# Altium project MB988.PrjPCB (part 1 of 2)
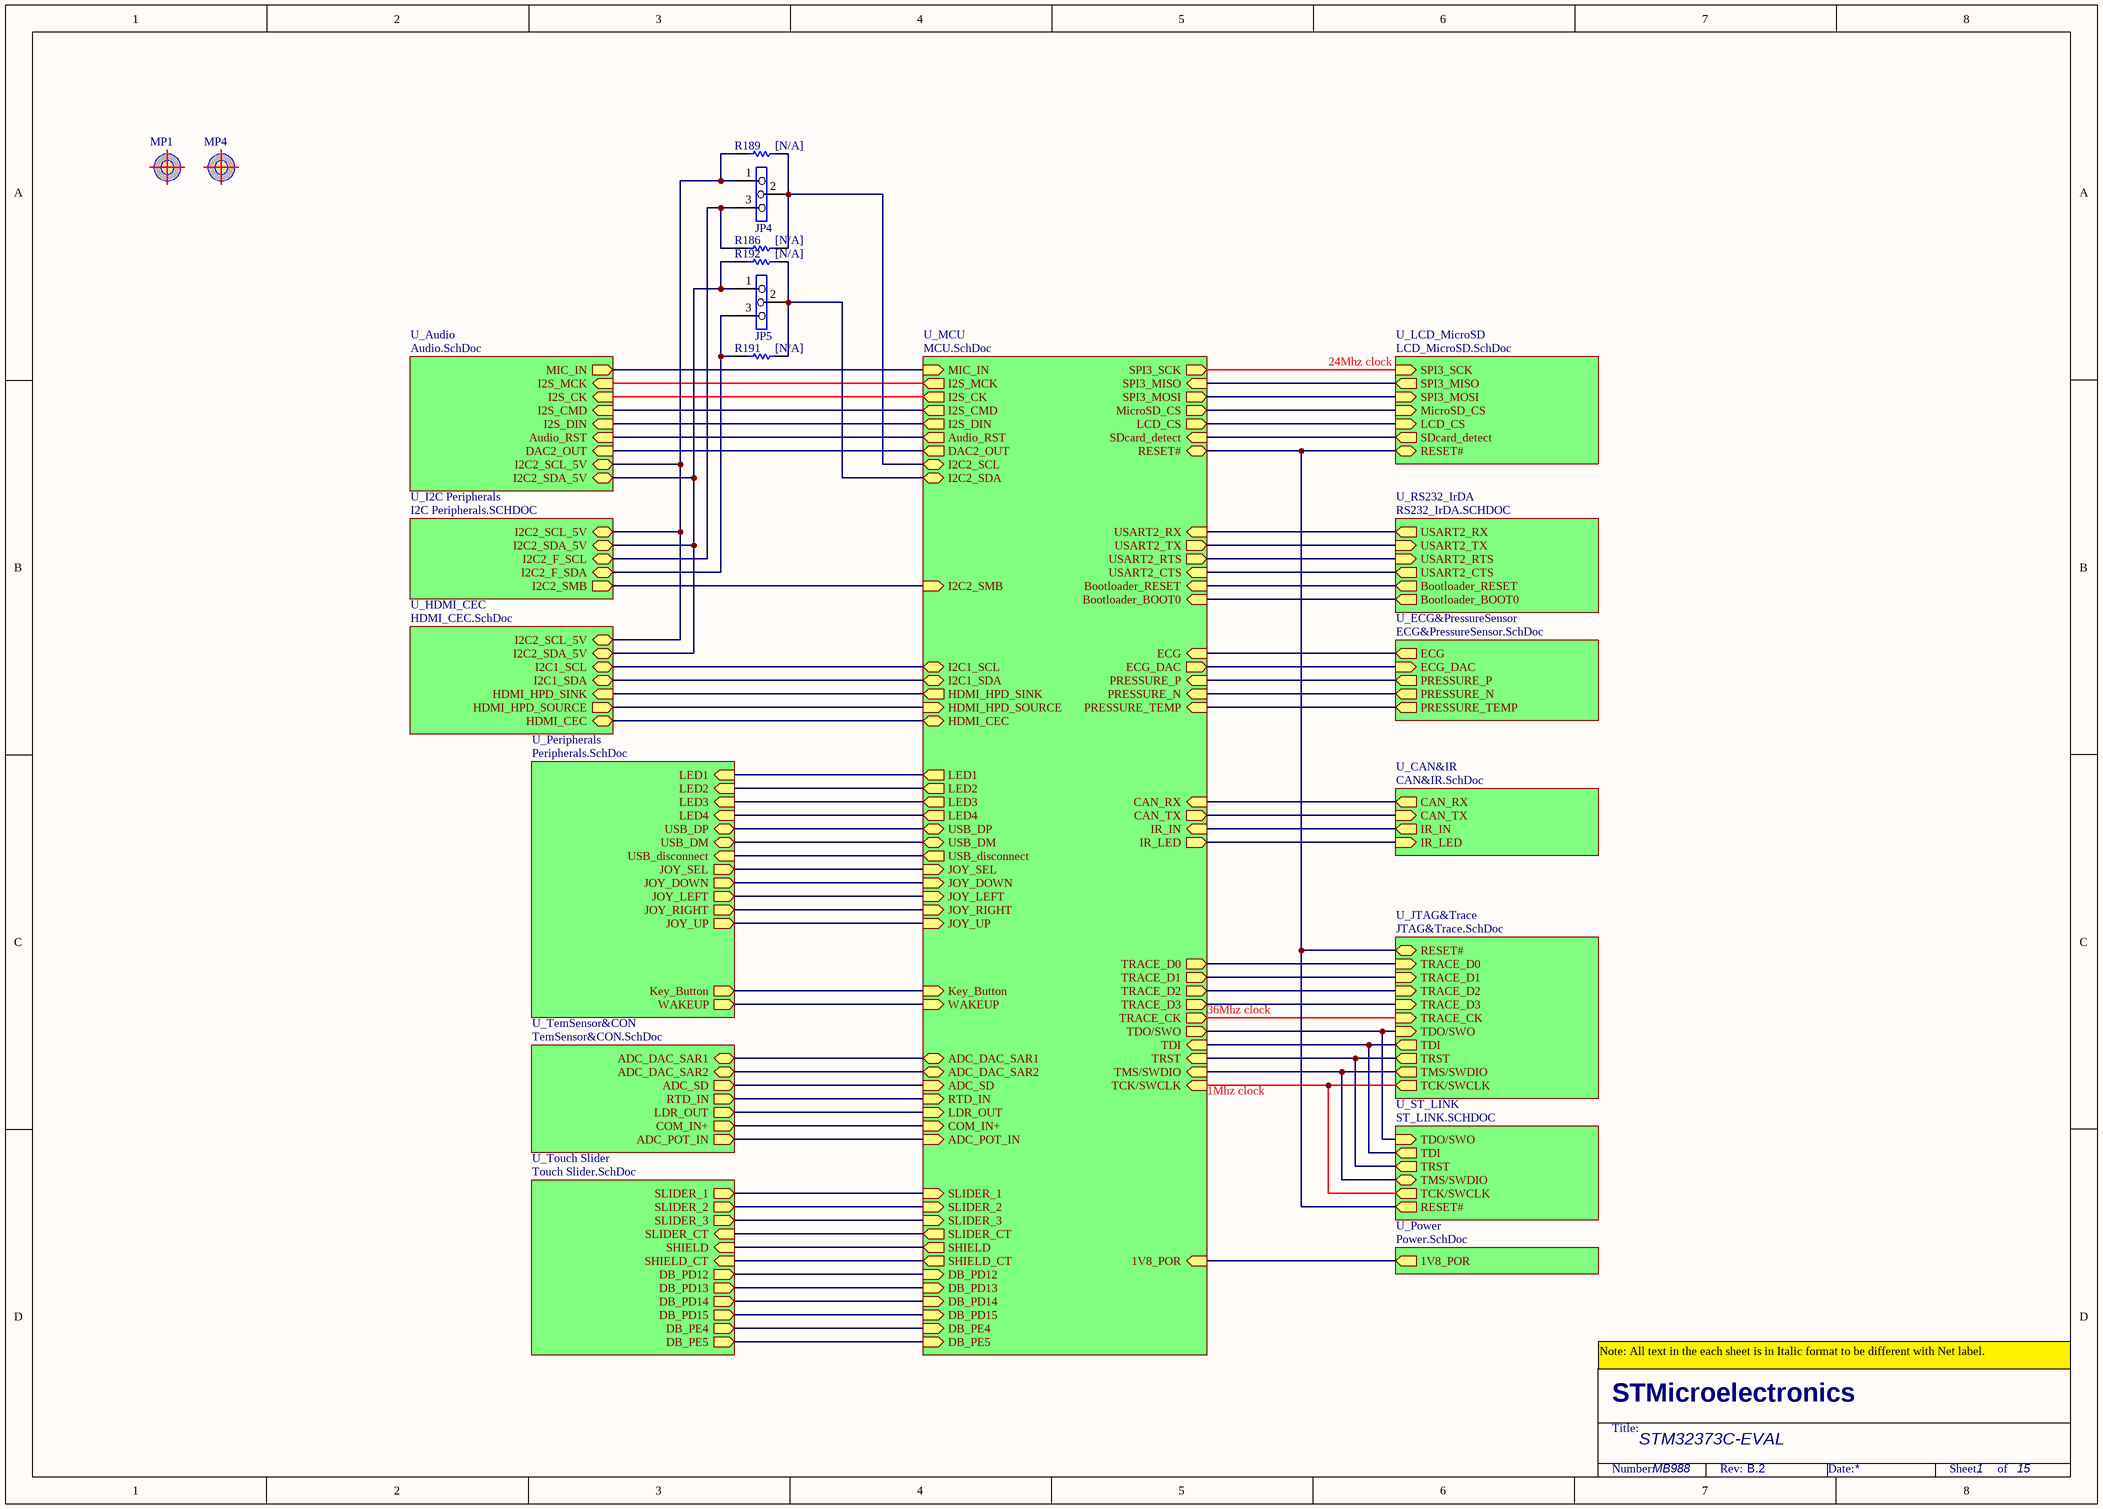
[diagram p0: MB988.SchDoc]
15 sheets, 536 parts. Net scope: hierarchical (ports join the sheet entries above them; power ports are global).
Sheets:
  MB988.SchDoc
    U_MCU = MCU.SchDoc
    U_Peripherals = Peripherals.SchDoc
    U_ECG&PressureSensor = ECG&PressureSensor.SchDoc
    U_TemSensor&CON = TemSensor&CON.SchDoc
    U_JTAG&Trace = JTAG&Trace.SchDoc
    U_ST_LINK = ST_LINK.SCHDOC
    U_Power = Power.SchDoc
    U_LCD_MicroSD = LCD_MicroSD.SchDoc
    U_Audio = Audio.SchDoc
    U_I2C Peripherals = I2C Peripherals.SCHDOC
    U_HDMI_CEC = HDMI_CEC.SchDoc
    U_RS232_IrDA = RS232_IrDA.SCHDOC
    U_Touch Slider = Touch Slider.SchDoc
    U_CAN&IR = CAN&IR.SchDoc

## Sheet MB988.SchDoc
size A3; Revision: B.2

### Parts
JP4  (no value)  [SIP3]
JP5  (no value)  [SIP3]
MP1  (no value)  [markpoint_1.0]
MP4  (no value)  [markpoint_1.0]
R186  [N/A]  [0603R]
R189  [N/A]  [0603R]
R191  [N/A]  [0603R]
R192  [N/A]  [0603R]

### Sub-sheets
U_Audio = Audio.SchDoc: I2S_CMD (in), I2S_DIN (in), I2S_CK (in), I2C2_SCL_5V (bidir), I2C2_SDA_5V (bidir), Audio_RST (in), I2S_MCK (in), DAC2_OUT (in), MIC_IN (out)
U_CAN&IR = CAN&IR.SchDoc: CAN_TX (in), CAN_RX (out), IR_LED (in), IR_IN (out)
U_ECG&PressureSensor = ECG&PressureSensor.SchDoc: ECG (out), PRESSURE_P (out), PRESSURE_N (out), ECG_DAC (in), PRESSURE_TEMP (out)
U_HDMI_CEC = HDMI_CEC.SchDoc: HDMI_HPD_SINK (in), I2C2_SDA_5V (bidir), I2C2_SCL_5V (bidir), HDMI_CEC (bidir), HDMI_HPD_SOURCE (out), I2C1_SCL (bidir), I2C1_SDA (bidir)
U_I2C Peripherals = I2C Peripherals.SCHDOC: I2C2_SCL_5V (bidir), I2C2_SDA_5V (bidir), I2C2_SMB (out), I2C2_F_SDA (bidir), I2C2_F_SCL (bidir)
U_JTAG&Trace = JTAG&Trace.SchDoc: TDI (out), RESET# (bidir), TRACE_D3 (in), TRACE_D2 (in), TRACE_D1 (in), TRACE_D0 (in), TRACE_CK (in), TRST (out), TMS/SWDIO (out), TCK/SWCLK (out), TDO/SWO (in)
U_LCD_MicroSD = LCD_MicroSD.SchDoc: MicroSD_CS (in), SPI3_SCK (in), SPI3_MOSI (in), LCD_CS (in), SPI3_MISO (out), SDcard_detect (out), RESET# (bidir)
U_MCU = MCU.SchDoc: WAKEUP (in), HDMI_HPD_SOURCE (in), SLIDER_3 (in), ADC_DAC_SAR2 (bidir), USB_DM (bidir), I2C2_SCL (bidir), I2C2_SDA (bidir), TMS/SWDIO (in), TCK/SWCLK (in), TDI (in), MIC_IN (in), COM_IN+ (in), TDO/SWO (out), TRST (in), IR_IN (in), HDMI_CEC (bidir), IR_LED (out), RESET# (bidir), LDR_OUT (in), SLIDER_2 (in), SLIDER_1 (in), USART2_RX (in), USART2_TX (out), USART2_RTS (out), USART2_CTS (in), ECG (in), ADC_SD (in), PRESSURE_N (in), PRESSURE_P (in), SPI3_MOSI (out), SPI3_MISO (in), SPI3_SCK (out), LED4 (out), LED3 (out), LED1 (out), I2S_MCK (out), I2S_CK (out), I2S_CMD (out), LED2 (out), Bootloader_BOOT0 (in), Bootloader_RESET (in), ADC_DAC_SAR1 (bidir), I2S_DIN (out), I2C2_SMB (in), USB_DP (bidir), CAN_RX (in), CAN_TX (out), SLIDER_CT (out), MicroSD_CS (out), TRACE_D0 (out), TRACE_D1 (out), Key_Button (in), JOY_SEL (in), RTD_IN (in), PRESSURE_TEMP (in), JOY_DOWN (in), JOY_LEFT (in), JOY_UP (in), JOY_RIGHT (in), DAC2_OUT (out), TRACE_CK (out), LCD_CS (out), SHIELD (out), TRACE_D2 (out), SHIELD_CT (out), TRACE_D3 (out), HDMI_HPD_SINK (out), Audio_RST (out), SDcard_detect (in), ECG_DAC (out), ADC_POT_IN (in), DB_PD14 (in), DB_PD13 (in), DB_PD12 (in), DB_PD15 (in), 1V8_POR (in), USB_disconnect (out), I2C1_SCL (bidir), I2C1_SDA (bidir), DB_PE4 (in), DB_PE5 (in)
U_Peripherals = Peripherals.SchDoc: LED4 (in), LED3 (in), LED1 (in), LED2 (in), JOY_SEL (out), JOY_DOWN (out), JOY_LEFT (out), JOY_RIGHT (out), JOY_UP (out), USB_DM (bidir), USB_DP (bidir), WAKEUP (out), Key_Button (out), USB_disconnect (in)
U_Power = Power.SchDoc: 1V8_POR (out)
U_RS232_IrDA = RS232_IrDA.SCHDOC: USART2_TX (in), USART2_CTS (out), Bootloader_RESET (out), Bootloader_BOOT0 (out), USART2_RX (out), USART2_RTS (in)
U_ST_LINK = ST_LINK.SCHDOC: TDI (out), TRST (out), TMS/SWDIO (bidir), TCK/SWCLK (out), TDO/SWO (in), RESET# (out)
U_TemSensor&CON = TemSensor&CON.SchDoc: RTD_IN (out), LDR_OUT (out), COM_IN+ (out), ADC_POT_IN (out), ADC_DAC_SAR1 (bidir), ADC_SD (out), ADC_DAC_SAR2 (bidir)
U_Touch Slider = Touch Slider.SchDoc: SLIDER_2 (out), SLIDER_3 (out), SHIELD (in), SHIELD_CT (in), SLIDER_1 (out), DB_PD14 (out), DB_PD13 (out), DB_PD12 (out), SLIDER_CT (in), DB_PD15 (out), DB_PE4 (out), DB_PE5 (out)

### Nets
PA0: sheet U_MCU/WAKEUP, sheet U_Peripherals/WAKEUP
PA1: sheet U_MCU/LDR_OUT, sheet U_TemSensor&CON/LDR_OUT
PA2: sheet U_MCU/Key_Button, sheet U_Peripherals/Key_Button
PA3: sheet U_MCU/COM_IN+, sheet U_TemSensor&CON/COM_IN+
PA4: sheet U_MCU/ADC_DAC_SAR1, sheet U_TemSensor&CON/ADC_DAC_SAR1
PA5: sheet U_MCU/ADC_DAC_SAR2, sheet U_TemSensor&CON/ADC_DAC_SAR2
PA8: sheet U_MCU/I2C2_SMB, sheet U_I2C Peripherals/I2C2_SMB
PA9: JP4.2 R186.1 R189.1 ; sheet U_MCU/I2C2_SCL
PA10: JP5.2 R191.1 R192.1 ; sheet U_MCU/I2C2_SDA
PA11: sheet U_MCU/USB_DM, sheet U_Peripherals/USB_DM
PA12: sheet U_MCU/USB_DP, sheet U_Peripherals/USB_DP
PA13: sheet U_MCU/TMS/SWDIO, sheet U_JTAG&Trace/TMS/SWDIO, sheet U_ST_LINK/TMS/SWDIO
PA14: sheet U_MCU/TCK/SWCLK, sheet U_JTAG&Trace/TCK/SWCLK, sheet U_ST_LINK/TCK/SWCLK
PA15: sheet U_MCU/TDI, sheet U_JTAG&Trace/TDI, sheet U_ST_LINK/TDI
PB0: sheet U_MCU/MIC_IN, sheet U_Audio/MIC_IN
PB1: sheet U_MCU/ADC_POT_IN, sheet U_TemSensor&CON/ADC_POT_IN
PB2: sheet U_MCU/1V8_POR, sheet U_Power/1V8_POR
PB3: sheet U_MCU/TDO/SWO, sheet U_JTAG&Trace/TDO/SWO, sheet U_ST_LINK/TDO/SWO
PB4: sheet U_MCU/TRST, sheet U_JTAG&Trace/TRST, sheet U_ST_LINK/TRST
PB5: sheet U_MCU/IR_IN, sheet U_CAN&IR/IR_IN
PB6: sheet U_MCU/I2C1_SCL, sheet U_HDMI_CEC/I2C1_SCL
PB7: sheet U_MCU/I2C1_SDA, sheet U_HDMI_CEC/I2C1_SDA
PB8: sheet U_MCU/HDMI_CEC, sheet U_HDMI_CEC/HDMI_CEC
PB9: sheet U_MCU/IR_LED, sheet U_CAN&IR/IR_LED
PC0: sheet U_MCU/LED1, sheet U_Peripherals/LED1
PC1: sheet U_MCU/LED2, sheet U_Peripherals/LED2
PC2: sheet U_MCU/LED3, sheet U_Peripherals/LED3
PC3: sheet U_MCU/LED4, sheet U_Peripherals/LED4
PC5: sheet U_MCU/USB_disconnect, sheet U_Peripherals/USB_disconnect
PC6: sheet U_MCU/I2S_CMD, sheet U_Audio/I2S_CMD
PC7: sheet U_MCU/I2S_CK, sheet U_Audio/I2S_CK
PC8: sheet U_MCU/I2S_MCK, sheet U_Audio/I2S_MCK
PC9: sheet U_MCU/I2S_DIN, sheet U_Audio/I2S_DIN
PC10: sheet U_MCU/SPI3_SCK, sheet U_LCD_MicroSD/SPI3_SCK
PC11: sheet U_MCU/SPI3_MISO, sheet U_LCD_MicroSD/SPI3_MISO
PC12: sheet U_MCU/SPI3_MOSI, sheet U_LCD_MicroSD/SPI3_MOSI
PD0: sheet U_MCU/CAN_RX, sheet U_CAN&IR/CAN_RX
PD1: sheet U_MCU/CAN_TX, sheet U_CAN&IR/CAN_TX
PD2: sheet U_MCU/LCD_CS, sheet U_LCD_MicroSD/LCD_CS
PD3: sheet U_MCU/USART2_CTS, sheet U_RS232_IrDA/USART2_CTS
PD4: sheet U_MCU/USART2_RTS, sheet U_RS232_IrDA/USART2_RTS
PD5: sheet U_MCU/USART2_TX, sheet U_RS232_IrDA/USART2_TX
PD6: sheet U_MCU/USART2_RX, sheet U_RS232_IrDA/USART2_RX
PD7: sheet U_MCU/HDMI_HPD_SOURCE, sheet U_HDMI_CEC/HDMI_HPD_SOURCE
PD11: sheet U_MCU/Audio_RST, sheet U_Audio/Audio_RST
PD12: sheet U_MCU/SLIDER_1, sheet U_Touch Slider/SLIDER_1
PD13: sheet U_MCU/SLIDER_2, sheet U_Touch Slider/SLIDER_2
PD14: sheet U_MCU/SLIDER_3, sheet U_Touch Slider/SLIDER_3
PD15: sheet U_MCU/SLIDER_CT, sheet U_Touch Slider/SLIDER_CT
PE0: sheet U_MCU/HDMI_HPD_SINK, sheet U_HDMI_CEC/HDMI_HPD_SINK
PE2: sheet U_MCU/TRACE_CK, sheet U_JTAG&Trace/TRACE_CK
PE3: sheet U_MCU/TRACE_D0, sheet U_JTAG&Trace/TRACE_D0
PE6: sheet U_MCU/JOY_SEL, sheet U_Peripherals/JOY_SEL
PE7: sheet U_MCU/RTD_IN, sheet U_TemSensor&CON/RTD_IN
PE8: sheet U_MCU/PRESSURE_P, sheet U_ECG&PressureSensor/PRESSURE_P
PE9: sheet U_MCU/PRESSURE_N, sheet U_ECG&PressureSensor/PRESSURE_N
PE11: sheet U_MCU/ADC_SD, sheet U_TemSensor&CON/ADC_SD
PE12: sheet U_MCU/ECG, sheet U_ECG&PressureSensor/ECG
PE14: sheet U_MCU/PRESSURE_TEMP, sheet U_ECG&PressureSensor/PRESSURE_TEMP
PF2: sheet U_MCU/JOY_DOWN, sheet U_Peripherals/JOY_DOWN
PF4: sheet U_MCU/JOY_LEFT, sheet U_Peripherals/JOY_LEFT
PF9: sheet U_MCU/JOY_RIGHT, sheet U_Peripherals/JOY_RIGHT
PF10: sheet U_MCU/JOY_UP, sheet U_Peripherals/JOY_UP
RESET#: sheet U_MCU/RESET#, sheet U_JTAG&Trace/RESET#, sheet U_ST_LINK/RESET#, sheet U_LCD_MicroSD/RESET#
NetCN2_15: JP4.1 R189.2 ; sheet U_Audio/I2C2_SCL_5V, sheet U_I2C Peripherals/I2C2_SCL_5V, sheet U_HDMI_CEC/I2C2_SCL_5V
NetCN2_16: JP5.1 R192.2 ; sheet U_Audio/I2C2_SDA_5V, sheet U_I2C Peripherals/I2C2_SDA_5V, sheet U_HDMI_CEC/I2C2_SDA_5V
NetCN7_2: sheet U_MCU/MicroSD_CS, sheet U_LCD_MicroSD/MicroSD_CS
NetCN7_10: sheet U_MCU/SDcard_detect, sheet U_LCD_MicroSD/SDcard_detect
NetCN13_43: sheet U_MCU/DB_PE5, sheet U_Touch Slider/DB_PE5
NetCN13_44: sheet U_MCU/DB_PE4, sheet U_Touch Slider/DB_PE4
NetCN14_2: sheet U_MCU/DB_PD15, sheet U_Touch Slider/DB_PD15
NetCN14_3: sheet U_MCU/DB_PD14, sheet U_Touch Slider/DB_PD14
NetCN14_4: sheet U_MCU/DB_PD13, sheet U_Touch Slider/DB_PD13
NetCN14_6: sheet U_MCU/DB_PD12, sheet U_Touch Slider/DB_PD12
NetCN15_18: sheet U_MCU/TRACE_D2, sheet U_JTAG&Trace/TRACE_D2
NetCN15_20: sheet U_MCU/TRACE_D3, sheet U_JTAG&Trace/TRACE_D3
NetD2_1: sheet U_MCU/Bootloader_BOOT0, sheet U_RS232_IrDA/Bootloader_BOOT0
NetJP4_3: JP4.3 R186.2 ; sheet U_I2C Peripherals/I2C2_F_SCL
NetJP5_3: JP5.3 R191.2 ; sheet U_I2C Peripherals/I2C2_F_SDA
NetJP7_3: sheet U_MCU/Bootloader_RESET, sheet U_RS232_IrDA/Bootloader_RESET
NetR29_1: sheet U_MCU/SHIELD, sheet U_Touch Slider/SHIELD
NetR72_1: sheet U_MCU/TRACE_D1, sheet U_JTAG&Trace/TRACE_D1
NetR73_1: sheet U_MCU/SHIELD_CT, sheet U_Touch Slider/SHIELD_CT
NetR92_2: sheet U_MCU/DAC2_OUT, sheet U_Audio/DAC2_OUT
NetR201_2: sheet U_MCU/ECG_DAC, sheet U_ECG&PressureSensor/ECG_DAC

### Notes on the sheet
- 24Mhz clock
- 36Mhz clock
- 1Mhz clock
- Note: All text in the each sheet is in Italic format to be different with Net label.
- STM32373C-EVAL
- MB988
- 1
- 15
- STMicroelectronics
- Title:
- Number:
- Rev:
- Date:
- Sheet       of

### Library data of the parts
JP4 JP5 = Jumper3
MP1 MP4 = MARKPOINT
R186 R189 R191 R192 = Res1: Resistor; Value: 1K; Published: 8-Jun-2000; Revision: July-2002: Re-released for DXP Platform.; Publisher: Altium Limited

## Sheet MCU.SchDoc
size A4; Revision: B.2
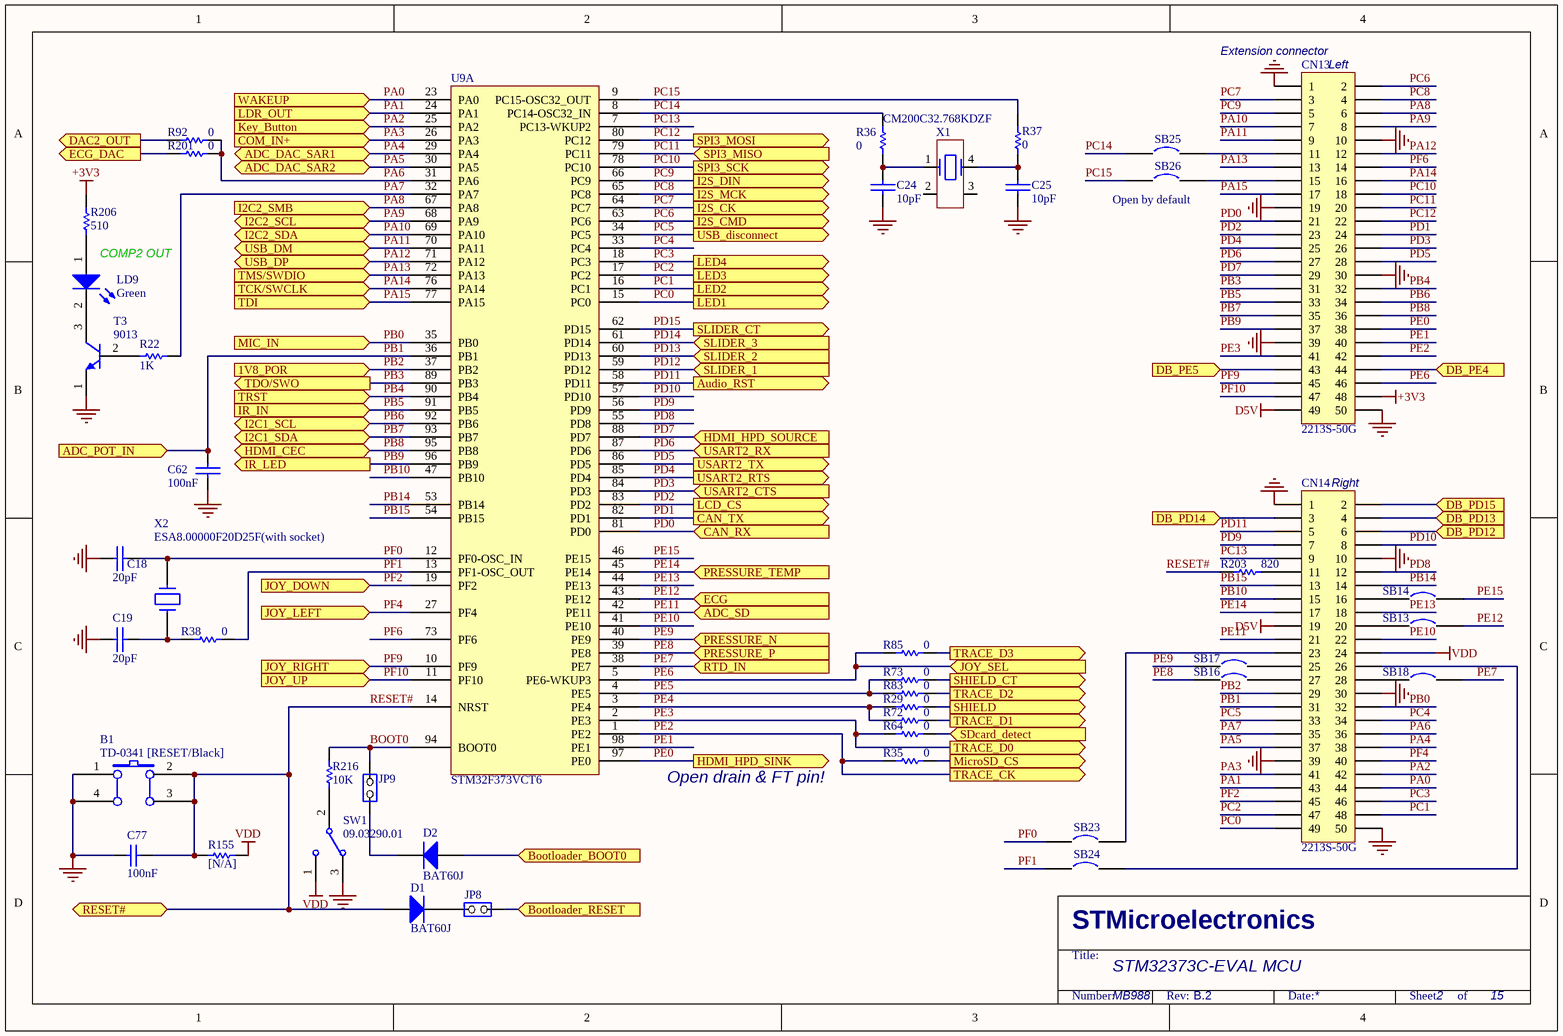
[diagram p1: MCU.SchDoc]

### Parts
B1  TD-0341 [RESET/Black]  [PB10]
C18  20pF  [0603C]
C19  20pF  [0603C]
C24  10pF  [0603C]
C25  10pF  [0603C]
C62  100nF  [0603C]
C77  100nF  [0603C]
CN13  2213S-50G  [2*25P]
CN14  2213S-50G  [2*25P]
D1  BAT60J  [SOD-323]
D2  BAT60J  [SOD-323]
JP8  (no value)  [SIP2]
JP9  (no value)  [SIP2]
LD9  Green  [0603D]
R22  1K  [0603R]
R29  0  [0603R]
R35  0  [0603R]
R36  0  [0603R]
R37  0  [0603R]
R38  0  [0603R]
R64  0  [0603R]
R72  0  [0603R]
R73  0  [0603R]
R83  0  [0603R]
R85  0  [0603R]
R92  0  [0603R]
R155  [N/A]  [0603R]
R201  0  [0603R]
R203  820  [0603R]
R206  510  [0603R]
R216  10K  [0603R]
SB13  (no value)  [JP2_SMD]
SB14  (no value)  [JP2_SMD]
SB16  (no value)  [JP2_SMD]
SB17  (no value)  [JP2_SMD]
SB18  (no value)  [JP2_SMD]
SB23  (no value)  [JP2_SMD]
SB24  (no value)  [JP2_SMD]
SB25  (no value)  [JP2_SMD]
SB26  (no value)  [JP2_SMD]
SW1  09.03290.01  [SIP3]
T3  9013  [SOT-23]
U9  STM32F373VCT6  [IC149-100-025-B5]  (part A of 2)
X1  CM200C32.768KDZF  [SM8]
X2  ESA8.00000F20D25F(with socket)  [XTAL_socket]

### Ports
1V8_POR (in), ADC_DAC_SAR1 (bidir), ADC_DAC_SAR2 (bidir), ADC_POT_IN (in), ADC_SD (in), Audio_RST (out), Bootloader_BOOT0 (in), Bootloader_RESET (in), CAN_RX (in), CAN_TX (out), COM_IN+ (in), DAC2_OUT (out), DB_PD12 (in), DB_PD13 (in), DB_PD14 (in), DB_PD15 (in), DB_PE4 (in), DB_PE5 (in), ECG (in), ECG_DAC (out), HDMI_CEC (bidir), HDMI_HPD_SINK (out), HDMI_HPD_SOURCE (in), I2C1_SCL (bidir), I2C1_SDA (bidir), I2C2_SCL (bidir), I2C2_SDA (bidir), I2C2_SMB (in), I2S_CK (out), I2S_CMD (out), I2S_DIN (out), I2S_MCK (out), IR_IN (in), IR_LED (out), JOY_DOWN (in), JOY_LEFT (in), JOY_RIGHT (in), JOY_SEL (in), JOY_UP (in), Key_Button (in), LCD_CS (out), LDR_OUT (in), LED1 (out), LED2 (out), LED3 (out), LED4 (out), MIC_IN (in), MicroSD_CS (out), PRESSURE_N (in), PRESSURE_P (in), PRESSURE_TEMP (in), RESET# (bidir), RTD_IN (in), SDcard_detect (in), SHIELD (out), SHIELD_CT (out), SLIDER_1 (in), SLIDER_2 (in), SLIDER_3 (in), SLIDER_CT (out), SPI3_MISO (in), SPI3_MOSI (out), SPI3_SCK (out), TCK/SWCLK (in), TDI (in), TDO/SWO (out), TMS/SWDIO (in), TRACE_CK (out), TRACE_D0 (out), TRACE_D1 (out), TRACE_D2 (out), TRACE_D3 (out), TRST (in), USART2_CTS (in), USART2_RTS (out), USART2_RX (in), USART2_TX (out), USB_disconnect (out), USB_DM (bidir), USB_DP (bidir), WAKEUP (in)

### Nets
+3V3: CN13.48 R206.1
D5V: CN13.49 CN14.19
GND: B1.1(A0) B1.4(A1) C18.2 C19.2 C24.2 C25.2 C62.1 C77.1 CN13.1 CN13.10 CN13.19 CN13.30 CN13.39 CN13.50 CN14.1 CN14.10 CN14.30 CN14.39 CN14.50 SW1.3 T3.1(E)
VDD: CN14.24 R155.2 SW1.1
BOOT0: JP9.2(NO) R216.1 U9.94(BOOT0)
PA0: CN14.44 U9.23(PA0) ; port WAKEUP
PA1: CN14.43 U9.24(PA1) ; port LDR_OUT
PA2: CN14.42 U9.25(PA2) ; port Key_Button
PA3: CN14.41 U9.26(PA3) ; port COM_IN+
PA4: CN14.38 U9.29(PA4) ; port ADC_DAC_SAR1
PA5: CN14.37 U9.30(PA5) ; port ADC_DAC_SAR2
PA6: CN14.36 R92.1 R201.1 U9.31(PA6)
PA7: CN14.35 R22.2 U9.32(PA7)
PA8: CN13.6 U9.67(PA8) ; port I2C2_SMB
PA9: CN13.8 U9.68(PA9) ; port I2C2_SCL
PA10: CN13.7 U9.69(PA10) ; port I2C2_SDA
PA11: CN13.9 U9.70(PA11) ; port USB_DM
PA12: CN13.12 U9.71(PA12) ; port USB_DP
PA13: CN13.13 U9.72(PA13) ; port TMS/SWDIO
PA14: CN13.16 U9.76(PA14) ; port TCK/SWCLK
PA15: CN13.17 U9.77(PA15) ; port TDI
PB0: CN14.32 U9.35(PB0) ; port MIC_IN
PB1: C62.2 CN14.31 U9.36(PB1) ; port ADC_POT_IN
PB2: CN14.29 U9.37(PB2) ; port 1V8_POR
PB3: CN13.31 U9.89(PB3) ; port TDO/SWO
PB4: CN13.32 U9.90(PB4) ; port TRST
PB5: CN13.33 U9.91(PB5) ; port IR_IN
PB6: CN13.34 U9.92(PB6) ; port I2C1_SCL
PB7: CN13.35 U9.93(PB7) ; port I2C1_SDA
PB8: CN13.36 U9.95(PB8) ; port HDMI_CEC
PB9: CN13.37 U9.96(PB9) ; port IR_LED
PB10: CN14.15 U9.47(PB10)
PB14: CN14.14 U9.53(PB14)
PB15: CN14.13 U9.54(PB15)
PC0: CN14.49 U9.15(PC0) ; port LED1
PC1: CN14.48 U9.16(PC1) ; port LED2
PC2: CN14.47 U9.17(PC2) ; port LED3
PC3: CN14.46 U9.18(PC3) ; port LED4
PC4: CN14.34 U9.33(PC4)
PC5: CN14.33 U9.34(PC5) ; port USB_disconnect
PC6: CN13.2 U9.63(PC6) ; port I2S_CMD
PC7: CN13.3 U9.64(PC7) ; port I2S_CK
PC8: CN13.4 U9.65(PC8) ; port I2S_MCK
PC9: CN13.5 U9.66(PC9) ; port I2S_DIN
PC10: CN13.18 U9.78(PC10) ; port SPI3_SCK
PC11: CN13.20 U9.79(PC11) ; port SPI3_MISO
PC12: CN13.22 U9.80(PC12) ; port SPI3_MOSI
PC13: CN14.9 U9.7(PC13-WKUP2)
PC14: R36.2 SB25.1 U9.8(PC14-OSC32_IN)
PC15: R37.2 SB26.1 U9.9(PC15-OSC32_OUT)
PD0: CN13.21 U9.81(PD0) ; port CAN_RX
PD1: CN13.24 U9.82(PD1) ; port CAN_TX
PD2: CN13.23 U9.83(PD2) ; port LCD_CS
PD3: CN13.26 U9.84(PD3) ; port USART2_CTS
PD4: CN13.25 U9.85(PD4) ; port USART2_RTS
PD5: CN13.28 U9.86(PD5) ; port USART2_TX
PD6: CN13.27 U9.87(PD6) ; port USART2_RX
PD7: CN13.29 U9.88(PD7) ; port HDMI_HPD_SOURCE
PD8: CN14.12 U9.55(PD8)
PD9: CN14.7 U9.56(PD9)
PD10: CN14.8 U9.57(PD10)
PD11: CN14.5 U9.58(PD11) ; port Audio_RST
PD12: U9.59(PD12) ; port SLIDER_1
PD13: U9.60(PD13) ; port SLIDER_2
PD14: U9.61(PD14) ; port SLIDER_3
PD15: U9.62(PD15) ; port SLIDER_CT
PE0: CN13.38 U9.97(PE0) ; port HDMI_HPD_SINK
PE1: CN13.40 U9.98(PE1)
PE2: CN13.42 R35.2 U9.1(PE2) ; port TRACE_CK
PE3: CN13.41 R64.2 U9.2(PE3) ; port TRACE_D0
PE4: R29.2 R72.2 U9.3(PE4)
PE5: R73.2 R83.2 U9.4(PE5)
PE6: CN13.46 R85.2 U9.5(PE6-WKUP3) ; port JOY_SEL
PE7: SB18.2 U9.38(PE7) ; port RTD_IN
PE8: SB16.1 U9.39(PE8) ; port PRESSURE_P
PE9: SB17.1 U9.40(PE9) ; port PRESSURE_N
PE10: CN14.22 U9.41(PE10)
PE11: CN14.21 U9.42(PE11) ; port ADC_SD
PE12: SB13.2 U9.43(PE12) ; port ECG
PE13: CN14.18 U9.44(PE13)
PE14: CN14.17 U9.45(PE14) ; port PRESSURE_TEMP
PE15: SB14.2 U9.46(PE15)
PF0: C18.1 SB23.1 U9.12(PF0-OSC_IN) X2.2
PF1: R38.1 SB24.1 U9.13(PF1-OSC_OUT)
PF2: CN14.45 U9.19(PF2) ; port JOY_DOWN
PF4: CN14.40 U9.27(PF4) ; port JOY_LEFT
PF6: CN13.14 U9.73(PF6)
PF9: CN13.45 U9.10(PF9) ; port JOY_RIGHT
PF10: CN13.47 U9.11(PF10) ; port JOY_UP
RESET#: B1.2(B0) B1.3(B1) C77.2 D1.1(A) R155.1 R203.2 U9.14(NRST) ; port RESET#
NetC19_1: C19.1 R38.2 X2.1
NetC24_1: C24.1 R36.1 X1.1
NetC25_1: C25.1 R37.1 X1.4
NetCN7_2: R35.1 ; port MicroSD_CS
NetCN7_10: R64.1 ; port SDcard_detect
NetCN13_11: CN13.11 SB25.2
NetCN13_15: CN13.15 SB26.2
NetCN13_43: CN13.43 ; port DB_PE5
NetCN13_44: CN13.44 ; port DB_PE4
NetCN14_2: CN14.2 ; port DB_PD15
NetCN14_3: CN14.3 ; port DB_PD14
NetCN14_4: CN14.4 ; port DB_PD13
NetCN14_6: CN14.6 ; port DB_PD12
NetCN14_11: CN14.11 R203.1
NetCN14_16: CN14.16 SB14.1
NetCN14_20: CN14.20 SB13.1
NetCN14_23: CN14.23 SB23.2
NetCN14_25: CN14.25 SB17.2
NetCN14_26: CN14.26 SB24.2
NetCN14_27: CN14.27 SB16.2
NetCN14_28: CN14.28 SB18.1
NetCN15_18: R83.1 ; port TRACE_D2
NetCN15_20: R85.1 ; port TRACE_D3
NetD1_2: D1.2(K) JP8.1(COMMON)
NetD2_1: D2.1(A) ; port Bootloader_BOOT0
NetD2_2: D2.2(K) JP9.1(COMMON)
NetJP7_3: JP8.2(NO) ; port Bootloader_RESET
NetLD9_1: LD9.1(A) R206.2
NetLD9_2: LD9.2(K) T3.3(C)
NetR22_1: R22.1 T3.2(B)
NetR29_1: R29.1 ; port SHIELD
NetR72_1: R72.1 ; port TRACE_D1
NetR73_1: R73.1 ; port SHIELD_CT
NetR92_2: R92.2 ; port DAC2_OUT
NetR201_2: R201.2 ; port ECG_DAC
NetR216_2: R216.2 SW1.2

Not connected (* = marked no-connect by the designer): X1 2 3

### Notes on the sheet
- (near CN13) Extension connector
- (near CN13) Left
- (near SB26) Open by default
- COMP2 OUT
- (near CN14) Right
- Open drain & FT pin!
- STM32373C-EVAL MCU
- MB988
- 2
- 15
- STMicroelectronics
- Title:
- Number:
- Rev:
- Date:
- Sheet       of

### Library data of the parts
B1 = SW PUSHBUTTON: SE PUSHBUTTON
C18 C19 C24 C25 C62 = CAP: Capacitor
C77 = CAP: Capacitor; Value: 100pF; Published: 8-Jun-2000; Revision: July-2002: Re-released for DXP Platform.; Publisher: Altium Limited
CN13 CN14 = Header 25X2: Header, 25-Pin, Dual row; Revision: 17-Jul-2002: Re-released for DXP Platform.; Publisher: Altium Limited
D1 D2 = Diode: Default Diode; Code - JEDEC: DO-214-AB; Published: 8-Jun-2000; Revision: July-2002: Re-released for DXP Platform.; Publisher: Altium Limited
JP8 JP9 = JP2
LD9 = LED2: Typical RED, GREEN, YELLOW, AMBER GaAs LED; Published: 8-Jun-2000; Revision: July-2002: Re-released for DXP Platform.; Publisher: Altium Limited
R22 = Res1: Resistor; Published: 8-Jun-2000; Revision: July-2002: Re-released for DXP Platform.; Publisher: Altium Limited; Value: 1K
R29 R35-R38 R64 R72 R73 R83 R85 R92 R201 R203 R206 = Res1: Resistor; Value: 1K; Published: 8-Jun-2000; Revision: July-2002: Re-released for DXP Platform.; Publisher: Altium Limited
R155 R216 = res1: Resistor; Value: 1K; Published: 8-Jun-2000; Revision: July-2002: Re-released for DXP Platform.; Publisher: Altium Limited
SB13 SB14 SB16-SB18 SB23-SB26 = Circuit Breaker: Published: 24-Mar-1999; Revision: July-2002: Re-released for DXP Platform.; Publisher: Altium Limited
SW1 = SW-SPDT: SPDT Subminiature Toggle Switch, Right Angle Mounting, Vertical Actuation; Revision 1: Jul-2002: Re-released for DXP Platform.; Revision 2: 17-Dec-2003: Schematic revised, PCB Footprint replaced.; Published: 24-Mar-1999; Datasheet: Latest Revision: 05-Dec-2000; Publisher: Altium Limited
T3 = NPN: NPN Bipolar Transistor; Code - JEDEC: TO-226-AA; Published: 8-Jun-2000; Revision: July-2002: Re-released for DXP Platform.; Publisher: Altium Limited
U9 = Goldfish
X1 = MC306
X2 = CRYSTAL

## Sheet Peripherals.SchDoc
size A4; Revision: B.2
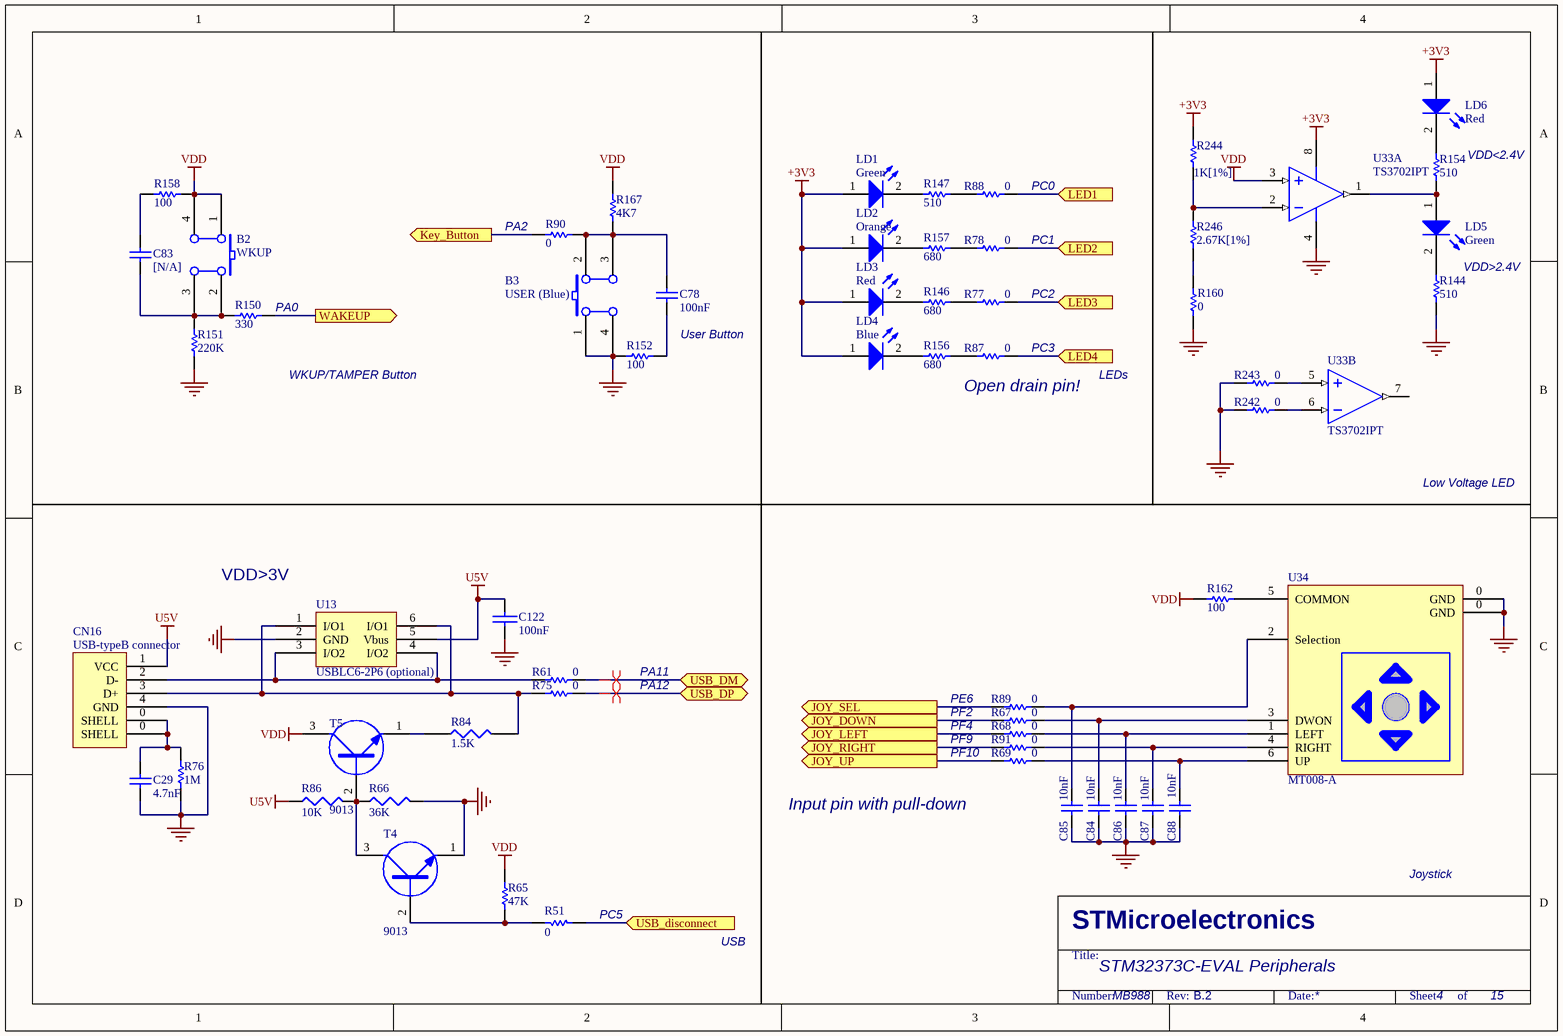
[diagram p2: Peripherals.SchDoc]

### Parts
B2  WKUP  [PB10]
B3  USER (Blue)  [PB10]
C29  4.7nF  [0603C]
C78  100nF  [0603C]
C83  [N/A]  [0603C]
C84  10nF  [0603C]
C85  10nF  [0603C]
C86  10nF  [0603C]
C87  10nF  [0603C]
C88  10nF  [0603C]
C122  100nF  [0603C]
CN16  USB-typeB connector  [USB-B]
LD1  Green  [0603D]
LD2  Orange  [0603D]
LD3  Red  [0603D]
LD4  Blue  [0603D]
LD5  Green  [0603D]
LD6  Red  [0603D]
R51  0  [0603R]
R61  0  [0603R]
R65  47K  [0603R]
R66  36K  [0603R]
R67  0  [0603R]
R68  0  [0603R]
R69  0  [0603R]
R75  0  [0603R]
R76  1M  [0603R]
R77  0  [0603R]
R78  0  [0603R]
R84  1.5K  [0603R]
R86  10K  [0603R]
R87  0  [0603R]
R88  0  [0603R]
R89  0  [0603R]
R90  0  [0603R]
R91  0  [0603R]
R144  510  [0603R]
R146  680  [0603R]
R147  510  [0603R]
R150  330  [0603R]
R151  220K  [0603R]
R152  100  [0603R]
R154  510  [0603R]
R156  680  [0603R]
R157  680  [0603R]
R158  100  [0603R]
R160  0  [0603R]
R162  100  [0603R]
R167  4K7  [0603R]
R242  0  [0603R]
R243  0  [0603R]
R244  1K[1%]  [0603R]
R246  2.67K[1%]  [0603R]
T4  9013  [SOT-23]
T5  9013  [SOT-23]
U13  USBLC6-2P6 (optional)  [SOT-666]
U33  TS3702IPT  [TSSOP8(6.4)]  (parts A,B of 2)
U34  MT008-A  [JOY]

### Ports
JOY_DOWN (out), JOY_LEFT (out), JOY_RIGHT (out), JOY_SEL (out), JOY_UP (out), Key_Button (out), LED1 (in), LED2 (in), LED3 (in), LED4 (in), USB_disconnect (in), USB_DM (bidir), USB_DP (bidir), WAKEUP (out)

### Nets
+3V3: LD1.1(A) LD2.1(A) LD3.1(A) LD4.1(A) LD6.1(A) R244.2 U33.8(V+)
GND: B3.1(A0) B3.4(A1) C29.1 C84.1 C85.1 C86.1 C87.1 C88.1 C122.2 CN16.4(GND) R66.2 R76.1 R144.2 R151.2 R152.1 R160.2 R242.2 R243.2 T4.1(E) U13.2(GND) U33.4(V-) U34.0(GND)
U5V: C122.1 CN16.1(VCC) R86.1 U13.5(Vbus)
VDD: B2.1(A0) B2.4(A1) R65.2 R158.1 R162.1 R167.2 T5.3(C) U33.3(IN+)
PA0: R150.2 ; port WAKEUP
PA2: R90.2 ; port Key_Button
PA11: R61.1 ; port USB_DM
PA12: R75.1 ; port USB_DP
PC0: R88.1 ; port LED1
PC1: R78.1 ; port LED2
PC2: R77.1 ; port LED3
PC3: R87.1 ; port LED4
PC5: R51.2 ; port USB_disconnect
PE6: R89.2 ; port JOY_SEL
PF2: R67.2 ; port JOY_DOWN
PF4: R68.2 ; port JOY_LEFT
PF9: R91.2 ; port JOY_RIGHT
PF10: R69.2 ; port JOY_UP
NetB2_2: B2.2(B0) B2.3(B1) C83.2 R150.1 R151.1
NetB3_2: B3.2(B0) B3.3(B1) C78.2 R90.1 R167.1
NetC29_2: C29.2 CN16.0(SHELL) R76.2
NetC78_1: C78.1 R152.2
NetC83_1: C83.1 R158.2
NetC84_2: C84.2 R67.1 U34.3(DWON)
NetC85_2: C85.2 R89.1 U34.2(Selection)
NetC86_2: C86.2 R68.1 U34.1(LEFT)
NetC87_2: C87.2 R91.1 U34.4(RIGHT)
NetC88_2: C88.2 R69.1 U34.6(UP)
NetCN16_2: CN16.2(D-) R61.2 U13.3(I/O2) U13.4(I/O2)
NetCN16_3: CN16.3(D+) R75.2 R84.2 U13.1(I/O1) U13.6(I/O1)
NetLD1_2: LD1.2(K) R147.2
NetLD2_2: LD2.2(K) R157.2
NetLD3_2: LD3.2(K) R146.2
NetLD4_2: LD4.2(K) R156.2
NetLD5_1: LD5.1(A) R154.2 U33.1(OUT)
NetLD5_2: LD5.2(K) R144.1
NetLD6_2: LD6.2(K) R154.1
NetR51_1: R51.1 R65.1 T4.2(B)
NetR66_1: R66.1 R86.2 T4.3(C) T5.2(B)
NetR77_2: R77.2 R146.1
NetR78_2: R78.2 R157.1
NetR84_1: R84.1 T5.1(E)
NetR87_2: R87.2 R156.1
NetR88_2: R88.2 R147.1
NetR160_1: R160.1 R246.1
NetR162_2: R162.2 U34.5(COMMON)
NetR242_1: R242.1 U33.6(IN-)
NetR243_1: R243.1 U33.5(IN+)
NetR244_1: R244.1 R246.2 U33.2(IN-)

Not connected (* = marked no-connect by the designer): U33 7(OUT)

### Layout directives
differential pair: PA11, PA12

### Notes on the sheet
- VDD<2.4V
- (near R90) PA2
- (near R88) PC0
- (near R78) PC1
- (near R150) PA0
- (near R77) PC2
- VDD>2.4V
- WKUP/TAMPER Button
- User Button
- (near R87) PC3
- LEDs
- Open drain pin!
- Low Voltage LED
- VDD>3V
- PA12
- PA11
- PF2
- PE6
- PF10
- PF9
- PF4
- Input pin with pull-down
- (near R51) PC5
- Joystick
- USB
- STM32373C-EVAL Peripherals
- MB988
- 4
- 15
- STMicroelectronics
- Title:
- Number:
- Rev:
- Date:
- Sheet       of

### Library data of the parts
B2 B3 = SW PUSHBUTTON: SE PUSHBUTTON
C29 C78 C83-C88 = CAP: Capacitor; Value: 100pF; Published: 8-Jun-2000; Revision: July-2002: Re-released for DXP Platform.; Publisher: Altium Limited
C122 = CAP: Capacitor
CN16 = USB-B
LD1-LD6 = LED2: as LD9 on sheet MCU; Published: 8-Jun-2000; Revision: July-2002: Re-released for DXP Platform.; Publisher: Altium Limited
R51 R61 R65 R67-R69 R75-R78 R87-R91 R144 R146 R147 R150 R152 R154 R156-R158 R160 R162 R242-R244 R246 = Res1: Resistor; Value: 1K; Published: 8-Jun-2000; Revision: July-2002: Re-released for DXP Platform.; Publisher: Altium Limited
R66 R86 = R: Right: 20; Bottom: 30
R84 = RES1
R151 R167 = res1: Resistor; Value: 1K; Published: 8-Jun-2000; Revision: July-2002: Re-released for DXP Platform.; Publisher: Altium Limited
T4 T5 = NPN
U13 = USBLC6-2
U33 = LM393PT
U34 = MT-008A

## Sheet ECG&PressureSensor.SchDoc
size A4; Revision: B.2
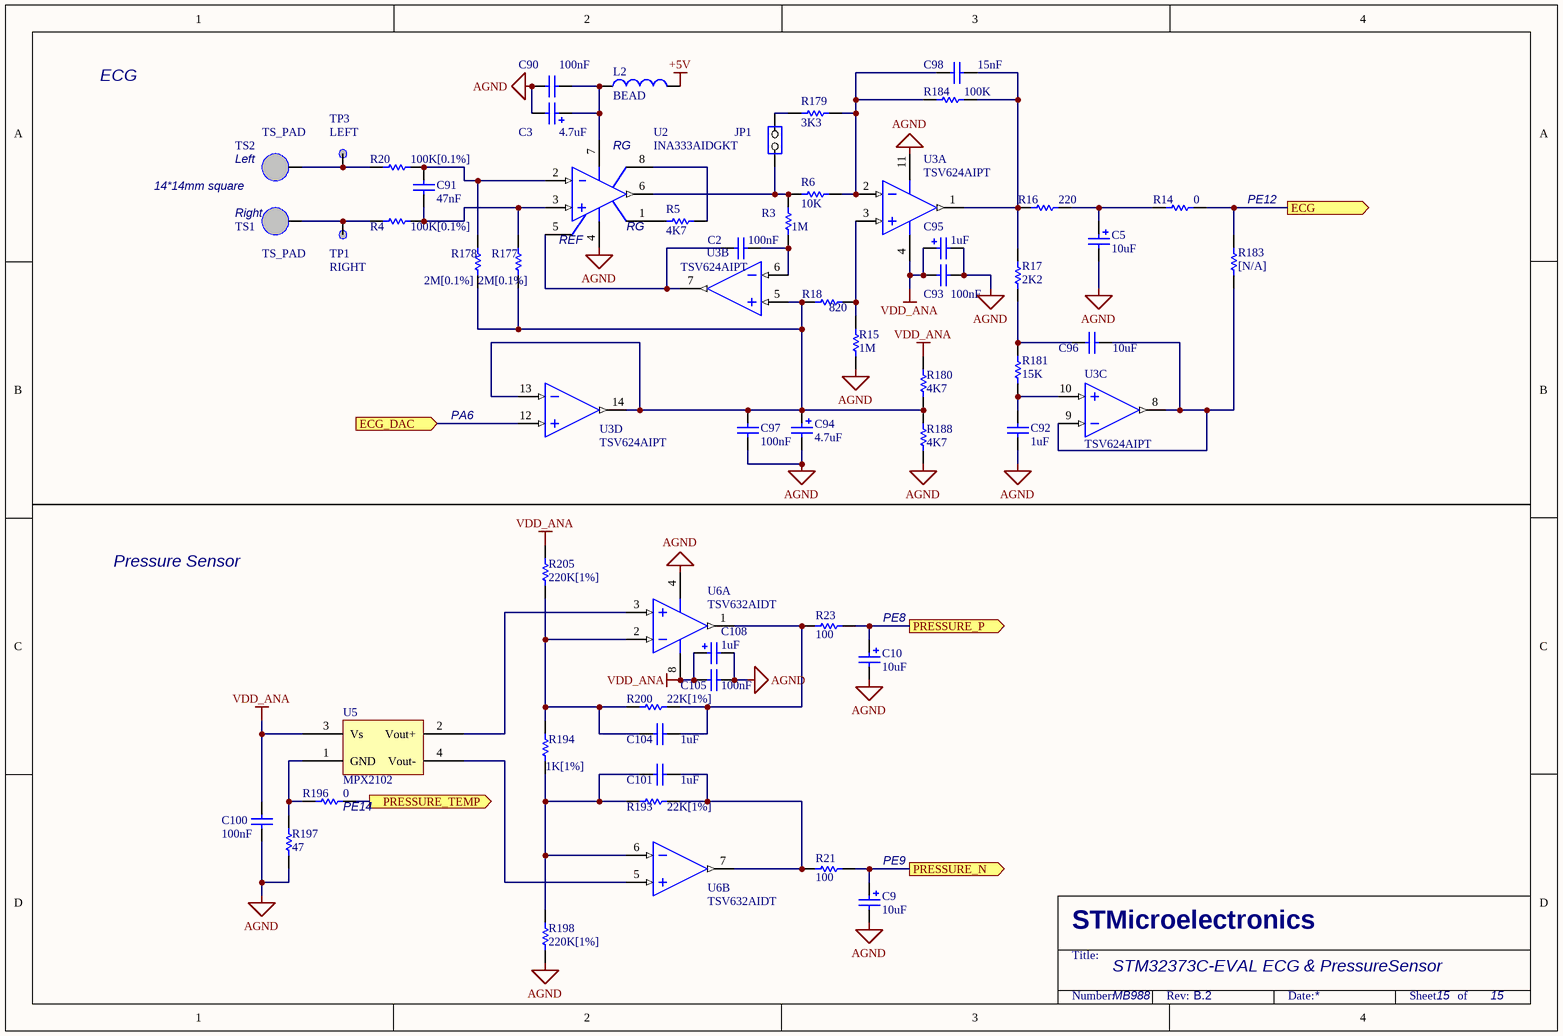
[diagram p3: ECG&PressureSensor.SchDoc]

### Parts
C2  100nF  [0603C]
C3  4.7uF  [TAN-A]
C5  10uF  [TAN-A]
C9  10uF  [TAN-A]
C10  10uF  [TAN-A]
C90  100nF  [0603C]
C91  47nF  [0603C]
C92  1uF  [0603C]
C93  100nF  [0603C]
C94  4.7uF  [TAN-A]
C95  1uF  [TAN-A]
C96  10uF  [0805C]
C97  100nF  [0603C]
C98  15nF  [0603C]
C100  100nF  [0603C]
C101  1uF  [0603C]
C104  1uF  [0603C]
C105  100nF  [0603C]
C108  1uF  [TAN-A]
JP1  (no value)  [SIP2]
L2  BEAD  [0603L]
R3  1M  [0603R]
R4  100K[0.1%]  [0603R]
R5  4K7  [0603R]
R6  10K  [0603R]
R14  0  [0603R]
R15  1M  [0603R]
R16  220  [0603R]
R17  2K2  [0603R]
R18  820  [0603R]
R20  100K[0.1%]  [0603R]
R21  100  [0603R]
R23  100  [0603R]
R177  2M[0.1%]  [0603R]
R178  2M[0.1%]  [0603R]
R179  3K3  [0603R]
R180  4K7  [0603R]
R181  15K  [0603R]
R183  [N/A]  [0603R]
R184  100K  [0603R]
R188  4K7  [0603R]
R193  22K[1%]  [0603R]
R194  1K[1%]  [0603R]
R196  0  [0603R]
R197  47  [0603R]
R198  220K[1%]  [0603R]
R200  22K[1%]  [0603R]
R205  220K[1%]  [0603R]
TP1  RIGHT  [TP]
TP3  LEFT  [TP]
TS1  TS_PAD  [TS_PAD]
TS2  TS_PAD  [TS_PAD]
U2  INA333AIDGKT  [MSOP8]
U3  TSV624AIPT  [TSSOP14]  (parts A,B,C,D of 4)
U5  MPX2102  [MPAK]
U6  TSV632AIDT  [SO8]  (parts A,B of 2)

### Ports
ECG (out), ECG_DAC (in), PRESSURE_N (out), PRESSURE_P (out), PRESSURE_TEMP (out)

### Nets
+5V: L2.2
AGND: C3.2 C5.2 C9.2 C10.2 C90.1 C92.1 C93.1 C94.2 C95.2 C97.1 C100.1 C105.1 C108.2 R15.1 R188.1 R197.1 R198.2 U2.4(V-) U3.11(V+) U6.4(V-)
VDD_ANA: C93.2 C95.1 C100.2 C105.2 C108.1 R180.2 R205.1 U3.4(V-) U5.3(Vs) U6.8(V+)
PE8: C10.1 R23.1 ; port PRESSURE_P
PE9: C9.1 R21.1 ; port PRESSURE_N
PE12: R14.1 R183.1 ; port ECG
PE14: R196.1 ; port PRESSURE_TEMP
NetC2_1: C2.1 U2.5(REF) U3.7(OUT)
NetC2_2: C2.2 R3.1 U3.6(IN-)
NetC3_1: C3.1 C90.2 L2.1 U2.7(V+)
NetC5_1: C5.1 R14.2 R16.2
NetC91_1: C91.1 R4.2 R177.2 U2.3(IN+)
NetC91_2: C91.2 R20.2 R178.2 U2.2(IN-)
NetC92_2: C92.2 R181.1 U3.10(IN+)
NetC94_1: C94.1 C97.2 R18.1 R177.1 R178.1 R180.1 R188.2 U3.5(IN+) U3.13(IN-) U3.14(OUT)
NetC96_1: C96.1 R17.2 R181.2
NetC96_2: C96.2 R183.2 U3.8(OUT) U3.9(IN-)
NetC98_1: C98.1 R16.1 R17.1 R184.2 U3.1(OUT)
NetC98_2: C98.2 R6.2 R179.1 R184.1 U3.2(IN-)
NetC101_1: C101.1 R193.1 R194.1 R198.1 U6.6(IN-)
NetC101_2: C101.2 R21.2 R193.2 U6.7(OUT)
NetC104_1: C104.1 R194.2 R200.1 R205.2 U6.2(IN-)
NetC104_2: C104.2 R23.2 R200.2 U6.1(OUT)
NetJP1_1: JP1.1(COMMON) R179.2
NetJP1_2: JP1.2(NO) R3.2 R6.1 U2.6(OUT)
NetR4_1: R4.1 TP1.1 TS1.1
NetR5_1: R5.1 U2.8(RG)
NetR5_2: R5.2 U2.1(RG)
NetR15_2: R15.2 R18.2 U3.3(IN+)
NetR20_1: R20.1 TP3.1 TS2.1
NetR196_2: R196.2 R197.2 U5.1(GND)
NetR201_2: U3.12(IN+) ; port ECG_DAC
NetU5_2: U5.2(Vout+) U6.3(IN+)
NetU5_4: U5.4(Vout-) U6.5(IN+)

### Notes on the sheet
- ECG
- (near TS2) Left
- (near U2) RG
- 14*14mm square
- (near TS1) Right
- (near U2) REF
- PE12
- PA6
- Pressure Sensor
- PE8
- (near R196) PE14
- PE9
- STM32373C-EVAL ECG & PressureSensor
- MB988
- 15
- STMicroelectronics
- Title:
- Number:
- Rev:
- Date:
- Sheet       of

### Library data of the parts
C2 C90 C91 C93 C97 C98 C100 C105 = CAP: Capacitor; Value: 100pF; Published: 8-Jun-2000; Revision: July-2002: Re-released for DXP Platform.; Publisher: Altium Limited
C3 C94 = Cap Pol1: Polarized Capacitor (Radial); Value: 100pF; Published: 8-Jun-2000; Revision: July-2002: Re-released for DXP Platform.; Publisher: Altium Limited
C5 C9 C10 = Cap Pol1: Polarized Capacitor (Radial); Published: 8-Jun-2000; Revision: July-2002: Re-released for DXP Platform.; Publisher: Altium Limited; Value: 10uF
C92 C96 C101 C104 = CAP: Capacitor; Value: 100nF; Published: 8-Jun-2000; Revision: July-2002: Re-released for DXP Platform.; Publisher: Altium Limited
C95 C108 = Cap Pol1: Polarized Capacitor (Radial); Value: 10uF; Published: 8-Jun-2000; Revision: July-2002: Re-released for DXP Platform.; Publisher: Altium Limited
JP1 = JP2
L2 = Inductor: Value: 100uH; Published: 8-Jun-2000; Revision: July-2002: Re-released for DXP Platform.; Publisher: Altium Limited
R3-R5 R14-R18 R20 R21 R23 R177-R181 R183 R184 R188 R193 R194 R196-R198 R200 R205 = Res1: Resistor; Value: 1K; Published: 8-Jun-2000; Revision: July-2002: Re-released for DXP Platform.; Publisher: Altium Limited
R6 = res1: Resistor; Value: 1K; Published: 8-Jun-2000; Revision: July-2002: Re-released for DXP Platform.; Publisher: Altium Limited
TP1 TP3 = TP
U2 = INA333
U3 = TSV624A

## Sheet TemSensor&CON.SchDoc
size A4; Revision: B.2
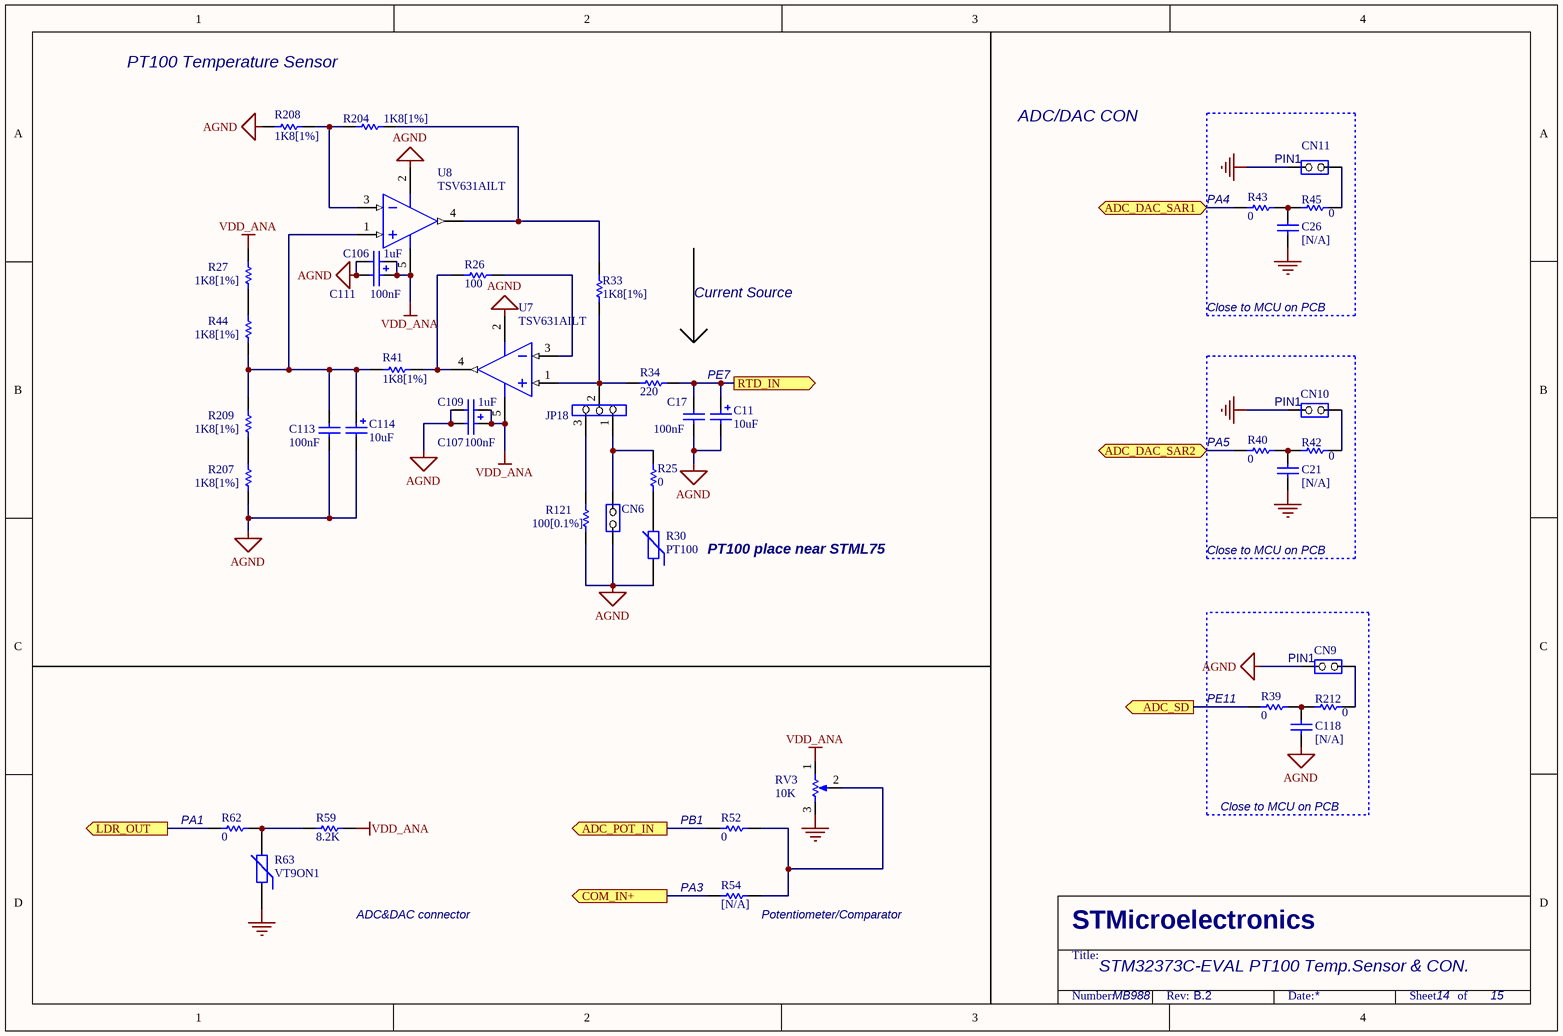
[diagram p4: TemSensor&CON.SchDoc]

### Parts
C11  10uF  [TAN-A]
C17  100nF  [0603C]
C21  [N/A]  [0603C]
C26  [N/A]  [0603C]
C106  1uF  [TAN-A]
C107  100nF  [0603C]
C109  1uF  [TAN-A]
C111  100nF  [0603C]
C113  100nF  [0603C]
C114  10uF  [TAN-A]
C118  [N/A]  [0603C]
CN6  (no value)  [SIP2]
CN9  (no value)  [SIP2]
CN10  (no value)  [SIP2]
CN11  (no value)  [SIP2]
JP18  (no value)  [SIP3]
R25  0  [0603R]
R26  100  [0603R]
R27  1K8[1%]  [0603R]
R30  PT100  [0805R]
R33  1K8[1%]  [0603R]
R34  220  [0603R]
R39  0  [0603R]
R40  0  [0603R]
R41  1K8[1%]  [0603R]
R42  0  [0603R]
R43  0  [0603R]
R44  1K8[1%]  [0603R]
R45  0  [0603R]
R52  0  [0603R]
R54  [N/A]  [0603R]
R59  8.2K  [0603R]
R62  0  [0603R]
R63  VT9ON1  [PVT901]
R121  100[0.1%]  [0603R]
R204  1K8[1%]  [0603R]
R207  1K8[1%]  [0603R]
R208  1K8[1%]  [0603R]
R209  1K8[1%]  [0603R]
R212  0  [0603R]
RV3  10K  [3296W]
U7  TSV631AILT  [SOT-23-5L]
U8  TSV631AILT  [SOT-23-5L]

### Ports
ADC_DAC_SAR1 (bidir), ADC_DAC_SAR2 (bidir), ADC_POT_IN (out), ADC_SD (out), COM_IN+ (out), LDR_OUT (out), RTD_IN (out)

### Nets
AGND: C11.2 C17.1 C106.2 C107.1 C109.2 C111.1 C113.1 C114.2 C118.1 CN6.2(NO) CN9.1(COMMON) R30.1 R121.2 R207.2 R208.1 U7.2(VDD) U8.2(VDD)
GND: C21.1 C26.1 CN10.1(COMMON) CN11.1(COMMON) R63.1 RV3.3(TOP)
VDD_ANA: C106.1 C107.2 C109.1 C111.2 R27.1 R59.2 RV3.1(BOT) U7.5(VCC) U8.5(VCC)
PA1: R62.2 ; port LDR_OUT
PA3: R54.1 ; port COM_IN+
PA4: R43.1 ; port ADC_DAC_SAR1
PA5: R40.1 ; port ADC_DAC_SAR2
PB1: R52.1 ; port ADC_POT_IN
PE7: C11.1 C17.2 R34.1 ; port RTD_IN
PE11: R39.1 ; port ADC_SD
NetC21_2: C21.2 R40.2 R42.1
NetC26_2: C26.2 R43.2 R45.1
NetC113_2: C113.2 C114.1 R41.1 R44.2 R209.1 U8.1(IN+)
NetC118_2: C118.2 R39.2 R212.1
NetCN6_1: CN6.1(COMMON) JP18.1 R25.1
NetCN9_2: CN9.2(NO) R212.2
NetCN10_2: CN10.2(NO) R42.2
NetCN11_2: CN11.2(NO) R45.2
NetJP18_2: JP18.2 R33.2 R34.2 U7.1(IN+)
NetJP18_3: JP18.3 R121.1
NetR25_2: R25.2 R30.2
NetR26_1: R26.1 U7.3(IN-)
NetR26_2: R26.2 R41.2 U7.4(OUT)
NetR27_2: R27.2 R44.1
NetR33_1: R33.1 R204.2 U8.4(OUT)
NetR52_2: R52.2 R54.2 RV3.2(TAP)
NetR59_1: R59.1 R62.1 R63.2
NetR204_1: R204.1 R208.2 U8.3(IN-)
NetR207_1: R207.1 R209.2

### Notes on the sheet
- PT100 Temperature Sensor
- ADC/DAC CON
- (near CN11) PIN1
- (near R43) PA4
- Current Source
- Close to MCU on PCB
- PE7
- (near R40) PA5
- (near CN10) PIN1
- PT100 place near STML75
- (near R39) PE11
- (near CN9) PIN1
- (near R62) PA1
- (near R52) PB1
- ADC&DAC connector
- (near R54) PA3
- (near R54) Potentiometer/Comparator
- STM32373C-EVAL PT100 Temp.Sensor & CON.
- MB988
- 14
- 15
- STMicroelectronics
- Title:
- Number:
- Rev:
- Date:
- Sheet       of

### Library data of the parts
C11 C114 = Cap Pol1: Polarized Capacitor (Radial); Published: 8-Jun-2000; Revision: July-2002: Re-released for DXP Platform.; Publisher: Altium Limited; Value: 10uF
C17 C107 C111 C113 = CAP: Capacitor; Value: 100pF; Published: 8-Jun-2000; Revision: July-2002: Re-released for DXP Platform.; Publisher: Altium Limited
C21 C26 C118 = cap: Capacitor; Value: 100pF; Published: 8-Jun-2000; Revision: July-2002: Re-released for DXP Platform.; Publisher: Altium Limited
C106 C109 = Cap Pol1: as C95 on sheet ECG&PressureSensor; Published: 8-Jun-2000; Revision: July-2002: Re-released for DXP Platform.; Publisher: Altium Limited
CN6 CN9-CN11 = JP2
JP18 = Jumper3
R25-R27 R33 R34 R39-R45 R52 R54 R59 R62 R121 R204 R207-R209 R212 = Res1: Resistor; Value: 1K; Published: 8-Jun-2000; Revision: July-2002: Re-released for DXP Platform.; Publisher: Altium Limited
R30 = PT100: Varistor (Voltage-Sensitive Resistor); Published: 24-Mar-1999; Revision: July-2002: Re-released for DXP Platform.; Publisher: Altium Limited
R63 = Res Varistor: Varistor (Voltage-Sensitive Resistor); Published: 24-Mar-1999; Revision: July-2002: Re-released for DXP Platform.; Publisher: Altium Limited
RV3 = RV

## Sheet JTAG&Trace.SchDoc
size A4; Revision: B.2
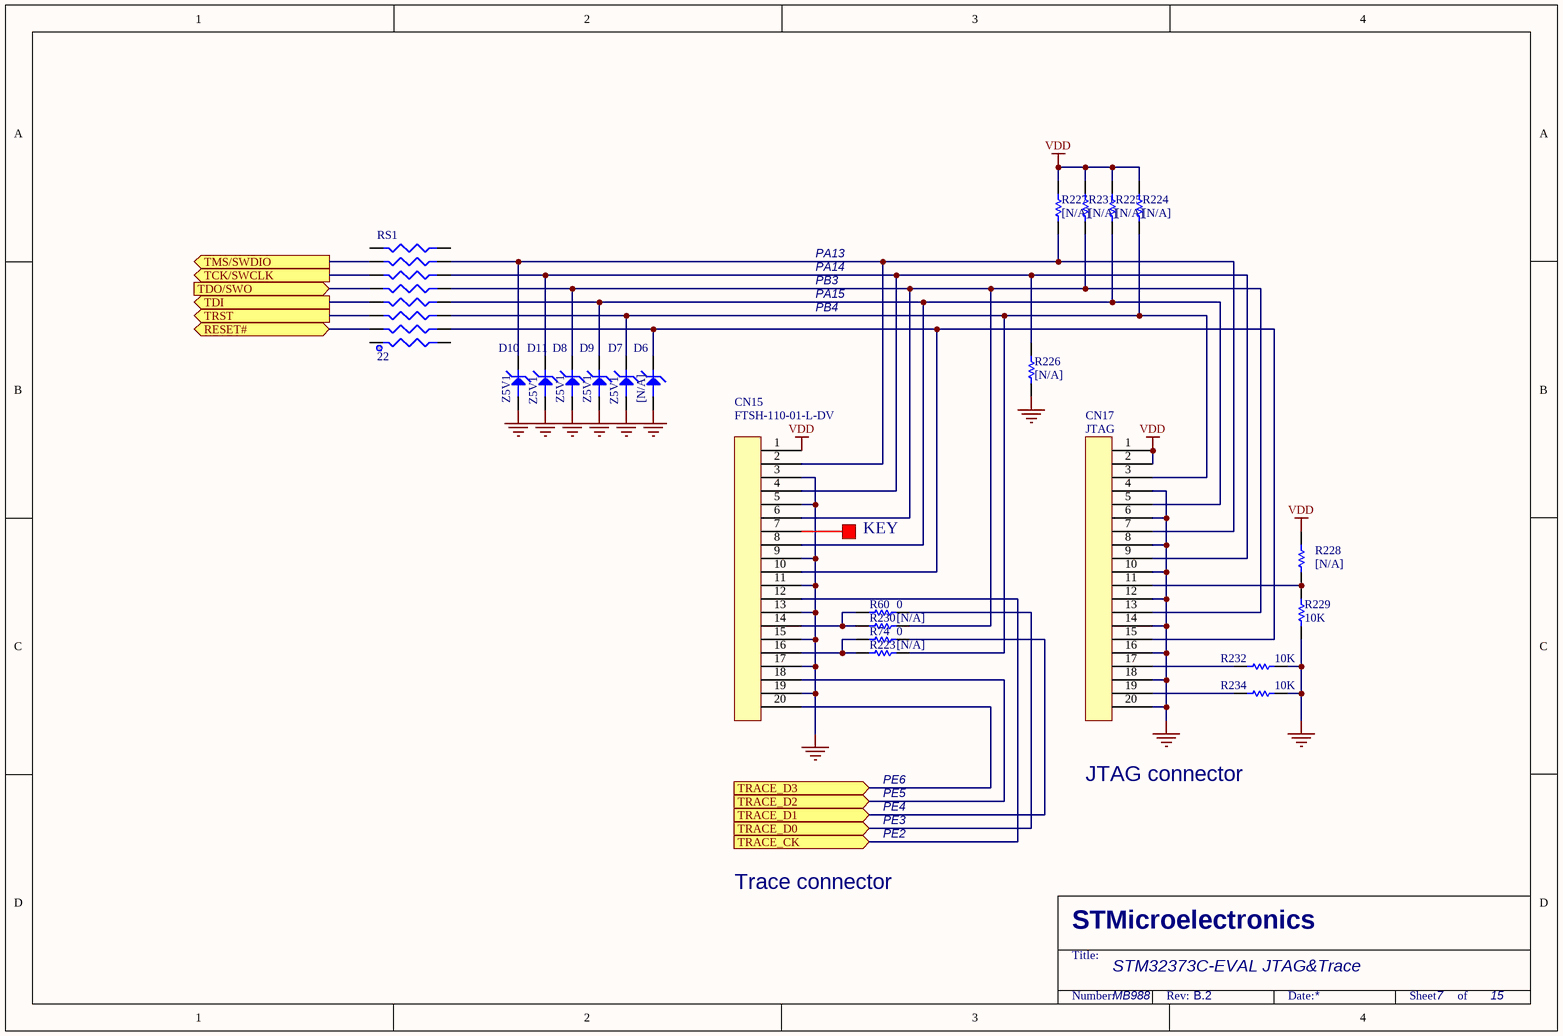
[diagram p5: JTAG&Trace.SchDoc]

### Parts
CN15  FTSH-110-01-L-DV  [FTSH-110-01-L-DV]
CN17  JTAG  [IDC20S]
D6  [N/A]  [SOT-23]
D7  Z5V1  [SOT-23]
D8  Z5V1  [SOT-23]
D9  Z5V1  [SOT-23]
D10  Z5V1  [SOT-23]
D11  Z5V1  [SOT-23]
R60  0  [0603R]
R74  0  [0603R]
R223  [N/A]  [0603R]
R224  [N/A]  [0603R]
R225  [N/A]  [0603R]
R226  [N/A]  [0603R]
R227  [N/A]  [0603R]
R228  [N/A]  [0603R]
R229  10K  [0603R]
R230  [N/A]  [0603R]
R231  [N/A]  [0603R]
R232  10K  [0603R]
R234  10K  [0603R]
RS1  22  [RES8B_0402]

### Ports
RESET# (bidir), TCK/SWCLK (out), TDI (out), TDO/SWO (in), TMS/SWDIO (out), TRACE_CK (in), TRACE_D0 (in), TRACE_D1 (in), TRACE_D2 (in), TRACE_D3 (in), TRST (out)

### Nets
GND: CN15.3 CN15.5 CN15.9 CN15.11 CN15.13 CN15.15 CN15.17 CN15.19 CN17.4 CN17.6 CN17.8 CN17.10 CN17.12 CN17.14 CN17.16 CN17.18 CN17.20 D6.2 D7.2 D8.2 D9.2 D10.2 D11.2 R226.1 R229.1 R232.1 R234.1
VDD: CN15.1 CN17.1 CN17.2 R224.2 R225.2 R227.2 R228.2 R231.2
PA13: RS1.13 ; port TMS/SWDIO
PA14: RS1.11 ; port TCK/SWCLK
PA15: RS1.7 ; port TDI
PB3: RS1.9 ; port TDO/SWO
PB4: RS1.5 ; port TRST
PE2: CN15.12 ; port TRACE_CK
PE3: R60.2 ; port TRACE_D0
RESET#: RS1.3 ; port RESET#
NetCN15_2: CN15.2 CN17.7 D10.3 R227.1 RS1.14
NetCN15_4: CN15.4 CN17.9 D11.3 R226.2 RS1.12
NetCN15_6: CN15.6 CN17.13 D8.3 R230.2 R231.1 RS1.10
NetCN15_8: CN15.8 CN17.5 D9.3 R225.1 RS1.8
NetCN15_10: CN15.10 CN17.15 D6.3 RS1.4
NetCN15_14: CN15.14 R60.1 R230.1
NetCN15_16: CN15.16 R74.1 R223.1
NetCN15_18: CN15.18 ; port TRACE_D2
NetCN15_20: CN15.20 ; port TRACE_D3
NetCN17_3: CN17.3 D7.3 R223.2 R224.1 RS1.6
NetCN17_11: CN17.11 R228.1 R229.2
NetCN17_17: CN17.17 R232.2
NetCN17_19: CN17.19 R234.2
NetR72_1: R74.2 ; port TRACE_D1

Not connected (* = marked no-connect by the designer): CN15 7; RS1 1 2 15 16

### Notes on the sheet
- PA13
- PA14
- PB3
- PA15
- PB4
- KEY
- PE6
- JTAG connector
- PE5
- PE4
- PE3
- PE2
- Trace connector
- STM32373C-EVAL JTAG&Trace
- MB988
- 7
- 15
- STMicroelectronics
- Title:
- Number:
- Rev:
- Date:
- Sheet       of

### Library data of the parts
CN15 CN17 = 20PIN1
D6-D11 = BATS5V6
R60 R74 R223-R232 R234 = Res1: Resistor; Value: 1K; Published: 8-Jun-2000; Revision: July-2002: Re-released for DXP Platform.; Publisher: Altium Limited
RS1 = RES8B

## Sheet ST_LINK.SCHDOC
size A4; Revision: B.2
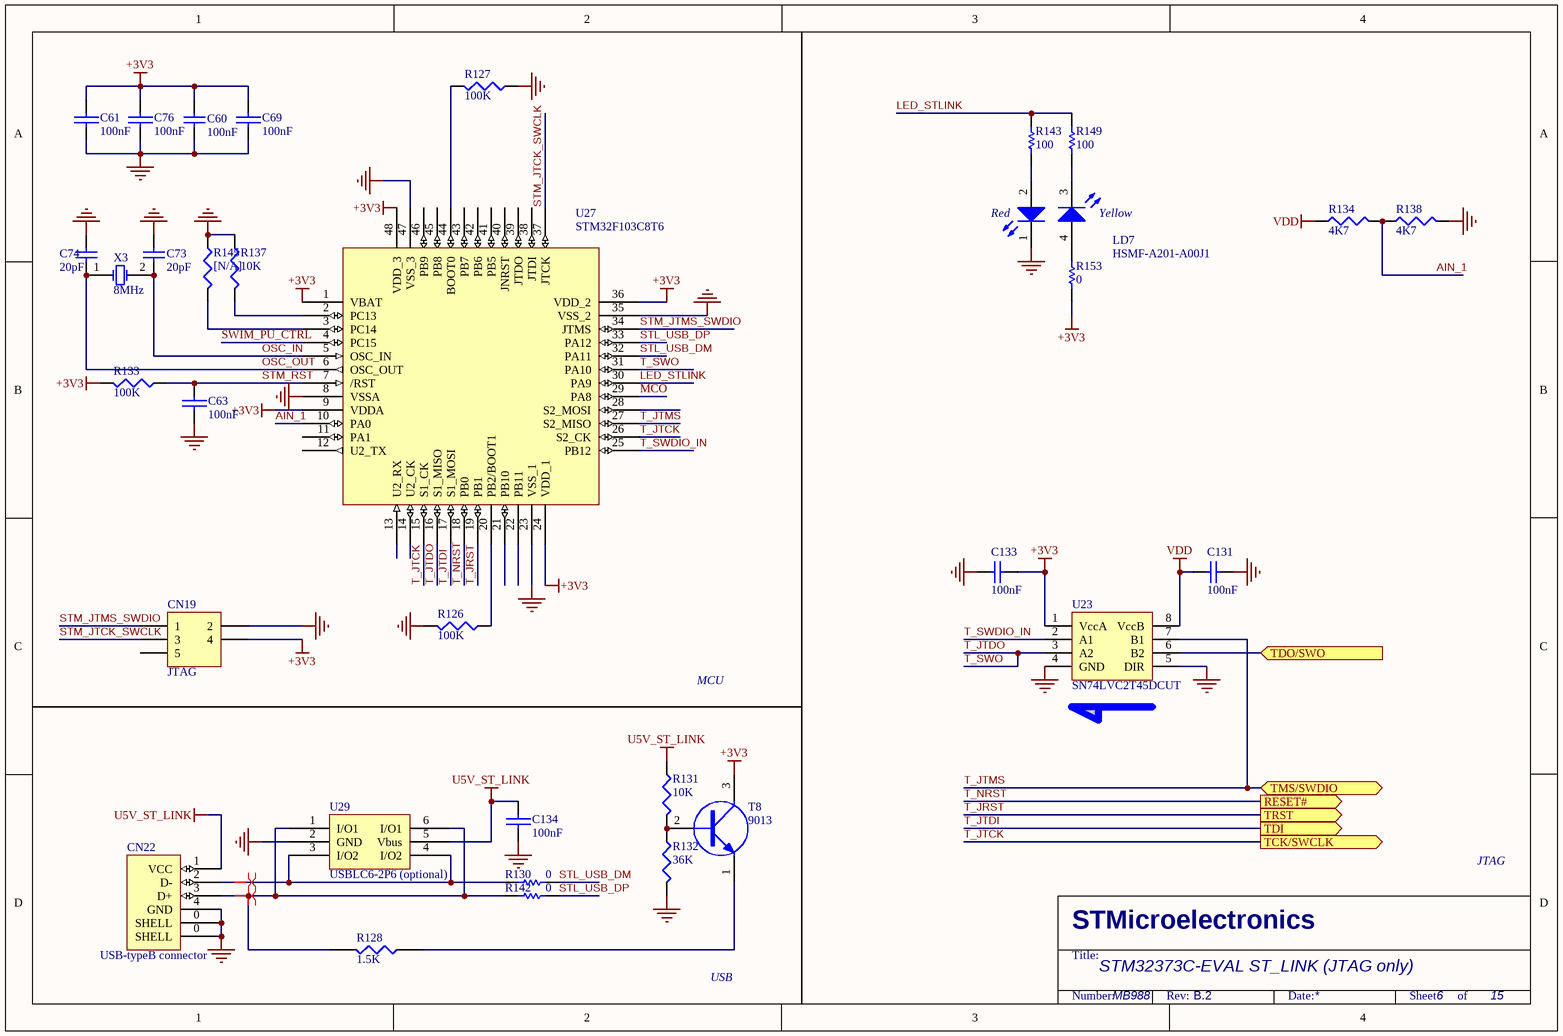
[diagram p6: ST_LINK.SCHDOC]

### Parts
C60  100nF  [0603C]
C61  100nF  [0603C]
C63  100nF  [0603C]
C69  100nF  [0603C]
C73  value 20pF  [0603R]  (hidden comment: Cap)
C74  value 20pF  [0603R]  (hidden comment: Cap)
C76  100nF  [0603C]
C131  100nF  [0603C]
C133  100nF  [0603C]
C134  100nF  [0603C]
CN19  JTAG  [2*3P]
CN22  USB-typeB connector  [USB-B]
LD7  HSMF-A201-A00J1  [LED2-28*32]
R126  100K  [0603R]
R127  100K  [0603R]
R128  1.5K  [0603R]
R130  0  [0603R]
R131  10K  [0603R]
R132  36K  [0603R]
R133  100K  [0603R]
R134  4K7  [0603R]
R137  10K  [0603R]
R138  4K7  [0603R]
R142  0  [0603R]
R143  100  [0603R]
R145  [N/A]  [0603R]
R149  100  [0603R]
R153  0  [0603R]
T8  9013  [SOT-23]
U23  SN74LVC2T45DCUT  [VSSOP8]
U27  STM32F103C8T6  [LQFP48]
U29  USBLC6-2P6 (optional)  [SOT-666]
X3  8MHz  [SMT_XTAL]

### Ports
RESET# (out), TCK/SWCLK (out), TDI (out), TDO/SWO (in), TMS/SWDIO (bidir), TRST (out)

### Nets
+3V3: C60.1 C61.2 C69.2 C76.2 C133.2 CN19.4 R133.2 R153.2 T8.3(C) U23.1(VccA) U27.1(VBAT) U27.9(VDDA) U27.24(VDD_1) U27.36(VDD_2) U27.48(VDD_3)
GND: C60.2 C61.1 C63.1 C69.1 C73.1 C74.1 C76.1 C131.2 C133.1 C134.2 CN19.2 CN22.0(SHELL) CN22.4(GND) LD7.1(RED_cathode) R126.2 R127.1 R132.2 R137.1 R138.2 R145.1 U23.4(GND) U23.5(DIR) U27.8(VSSA) U27.23(VSS_1) U27.35(VSS_2) U27.47(VSS_3) U29.2(GND)
U5V_ST_LINK: C134.1 CN22.1(VCC) R131.1 U29.5(Vbus)
VDD: C131.1 R134.1 U23.8(VccB)
AIN_1: R134.2 R138.1 U27.10(PA0)
LED_STLINK: R143.1 R149.1 U27.30(PA9)
MCO: U27.29(PA8)
OSC_IN: C73.2 U27.5(OSC_IN) X3.2(OSC2)
OSC_OUT: C74.2 U27.6(OSC_OUT) X3.1(OSC1)
PB3: U23.6(B2) ; port TDO/SWO
STL_USB_DM: R130.1 U27.32(PA11)
STL_USB_DP: R142.1 U27.33(PA12)
STM_JTCK_SWCLK: CN19.3 U27.37(JTCK)
STM_JTMS_SWDIO: CN19.1 U27.34(JTMS)
STM_RST: C63.2 R133.1 U27.7(/RST)
SWIM_PU_CTRL: U27.4(PC15)
T_JRST: U27.19(PB1) ; port TRST  [project net PB4]
T_JTCK: U27.15(S1_CK) U27.26(S2_CK) ; port TCK/SWCLK  [project net PA14]
T_JTDI: U27.17(S1_MOSI) ; port TDI  [project net PA15]
T_JTDO: U23.3(A2) U27.16(S1_MISO) U27.31(PA10)  [also labelled T_SWO]
T_JTMS: U23.7(B1) U27.27(S2_MISO) ; port TMS/SWDIO  [project net PA13]
T_NRST: U27.18(PB0) ; port RESET#  [project net RESET#]
T_SWDIO_IN: U23.2(A1) U27.25(PB12)
NetCN22_2: CN22.2(D-) R130.2 U29.3(I/O2) U29.4(I/O2)
NetCN22_3: CN22.3(D+) R128.2 R142.2 U29.1(I/O1) U29.6(I/O1)
NetLD7_2: LD7.2(Red_anode) R143.2
NetLD7_3: LD7.3(YellowGreen_cathode) R149.2
NetLD7_4: LD7.4(YellowGreen_anode) R153.1
NetR126_1: R126.1 U27.20(PB2/BOOT1)
NetR127_2: R127.2 U27.44(BOOT0)
NetR128_1: R128.1 T8.1(E)
NetR131_2: R131.2 R132.1 T8.2(B)
NetR137_2: R137.2 U27.2(PC13)
NetR145_2: R145.2 U27.3(PC14)

Not connected (* = marked no-connect by the designer): CN19 5; U27 11(PA1) 12(U2_TX) 13(U2_RX) 14(U2_CK) 21(PB10) 22(PB11) 28(S2_MOSI) 38(JTDI) 39(JTDO) 40(JNRST) 41(PB5) 42(PB6) 43(PB7) 45(PB8) 46(PB9)

### Layout directives
differential pair: NetCN22_2, NetCN22_3

### Notes on the sheet
- MCU
- JTAG
- USB
- STM32373C-EVAL ST_LINK (JTAG only)
- MB988
- 6
- 15
- STMicroelectronics
- Title:
- Number:
- Rev:
- Date:
- Sheet       of
- (in symbol HSMF-A201-A00J1) Red; Yellow

### Library data of the parts
C60 = Cap: Capacitor; Value: 10nF; Published: 8-Jun-2000; Revision: July-2002: Re-released for DXP Platform.; Publisher: Altium Limited
C61 C63 C69 C76 = CAP
C73 C74 = Cap: Capacitor; Published: 8-Jun-2000; LatestRevisionDate: 17-Jul-2002; LatestRevisionNote: Re-released for DXP Platform.; PackageReference: RAD-0.3; Publisher: Altium Limited
C131 C133 = CAP: Capacitor; Value: 100pF; Published: 8-Jun-2000; Revision: July-2002: Re-released for DXP Platform.; Publisher: Altium Limited
C134 = CAP: Capacitor
CN19 = Header 3X2: Header, 3-Pin, Dual row; Revision: 17-Jul-2002: Re-released for DXP Platform.; Publisher: Altium Limited
R126-R128 R133 R134 R138 = RES1
R130 R142 R143 R149 R153 = Res1: Resistor; Value: 1K; Published: 8-Jun-2000; Revision: July-2002: Re-released for DXP Platform.; Publisher: Altium Limited
R131 R132 R137 R145 = R: Right: 20; Bottom: 30
T8 = NPN
U27 = STM32F10x(48pin)
U29 = USBLC6-2
X3 = XTAL: Crystal Oscillator; Published: 8-Jun-2000; LatestRevisionDate: 17-Jul-2002; LatestRevisionNote: Re-released for DXP Platform.; PackageReference: R38; Publisher: Altium Limited

## Sheet Power.SchDoc
size A4; Revision: B.2
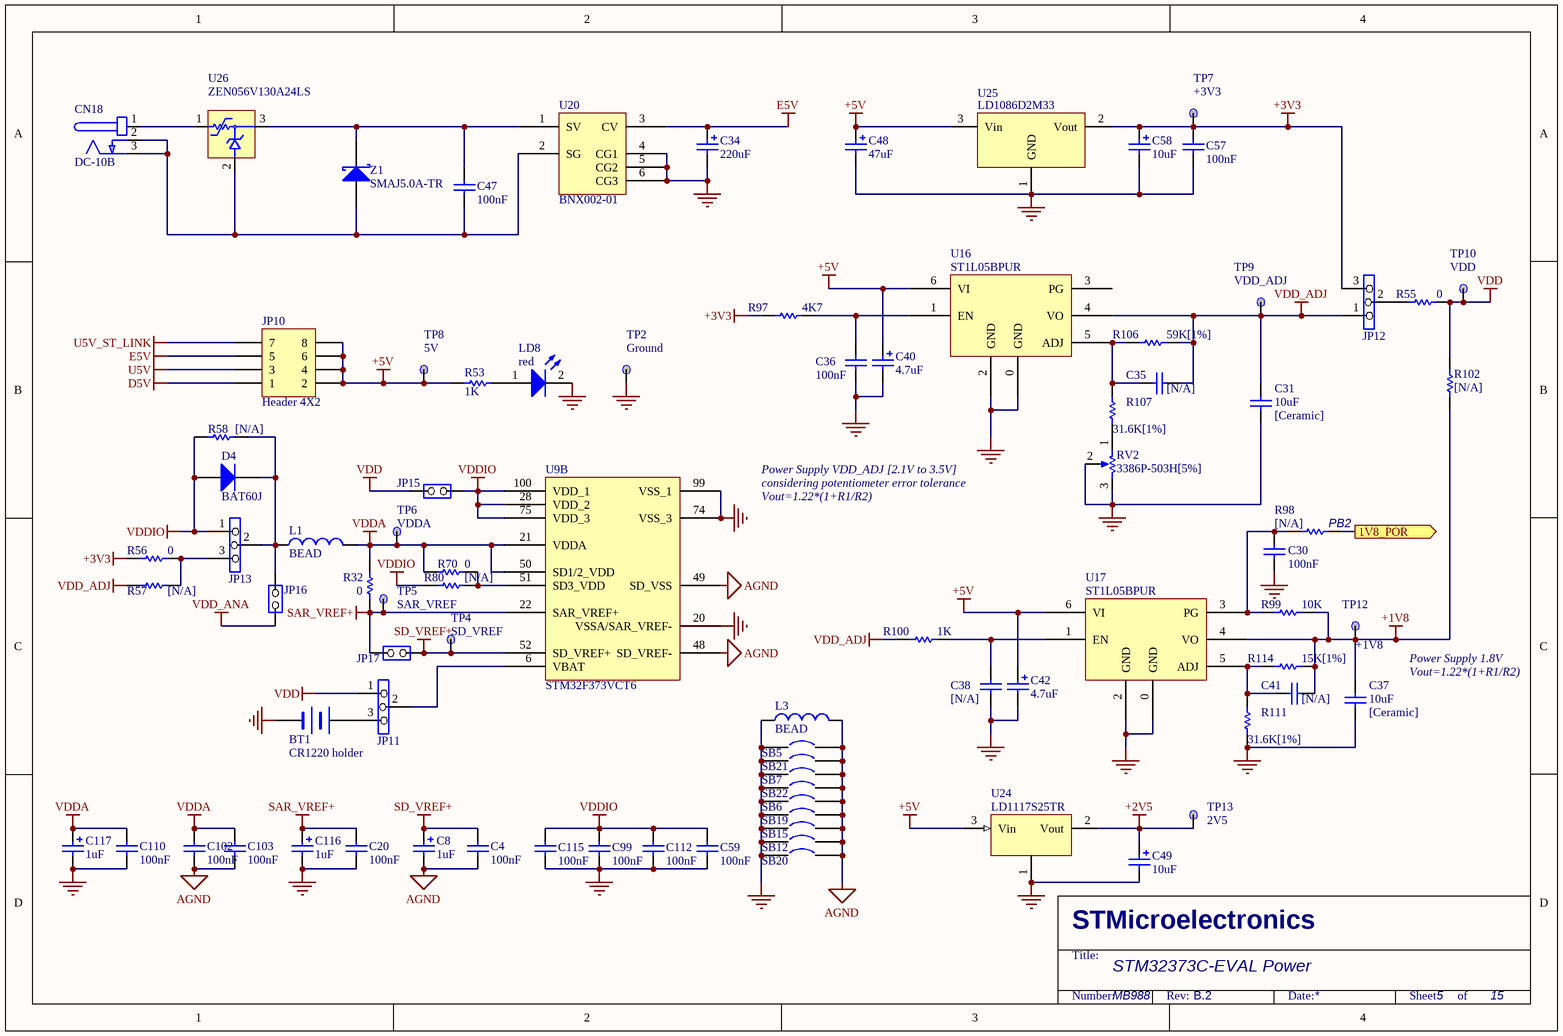
[diagram p7: Power.SchDoc]

### Parts
BT1  CR1220 holder  [LI1220_1]
C4  100nF  [0603C]
C8  1uF  [TAN-A]
C20  100nF  [0603C]
C30  100nF  [0603C]
C31  10uF  [0805C]
C34  220uF  [C310M]
C35  [N/A]  [0603C]
C36  100nF  [0603C]
C37  10uF  [0805C]
C38  [N/A]  [0603C]
C40  4.7uF  [TAN-A]
C41  [N/A]  [0603C]
C42  4.7uF  [TAN-A]
C47  100nF  [0603C]
C48  47uF  [C200M]
C49  10uF  [TAN-A]
C57  100nF  [0603C]
C58  10uF  [TAN-A]
C59  100nF  [0603C]
C99  100nF  [0603C]
C102  100nF  [0603C]
C103  100nF  [0603C]
C110  100nF  [0603C]
C112  100nF  [0603C]
C115  100nF  [0603C]
C116  1uF  [TAN-A]
C117  1uF  [TAN-A]
CN18  DC-10B  [DC10B]
D4  BAT60J  [SOD-323]
JP10  Header 4X2  [2*4P]
JP11  (no value)  [SIP3]
JP12  (no value)  [SIP3]
JP13  (no value)  [SIP3]
JP15  (no value)  [SIP2]
JP16  (no value)  [SIP2]
JP17  (no value)  [SIP2]
L1  BEAD  [0603L]
L3  BEAD  [0603L]
LD8  red  [0603D]
R32  0  [0603R]
R53  1K  [0603R]
R55  0  [0603R]
R56  0  [0603R]
R57  [N/A]  [0603R]
R58  [N/A]  [0603R]
R70  0  [0603R]
R80  [N/A]  [0603R]
R97  4K7  [0603R]
R98  [N/A]  [0603R]
R99  10K  [0603R]
R100  1K  [0603R]
R102  [N/A]  [0603R]
R106  59K[1%]  [0603R]
R107  31.6K[1%]  [0603R]
R111  31.6K[1%]  [0603R]
R114  15K[1%]  [0603R]
RV2  3386P-503H[5%]  [3296W]
SB5  (no value)  [JP2_SMD]
SB6  (no value)  [JP2_SMD]
SB7  (no value)  [JP2_SMD]
SB12  (no value)  [JP2_SMD]
SB15  (no value)  [JP2_SMD]
SB19  (no value)  [JP2_SMD]
SB20  (no value)  [JP2_SMD]
SB21  (no value)  [JP2_SMD]
SB22  (no value)  [JP2_SMD]
TP2  Ground  [TP]
TP4  SD_VREF  [TP]
TP5  SAR_VREF  [TP]
TP6  VDDA  [TP]
TP7  +3V3  [TP]
TP8  5V  [TP]
TP9  VDD_ADJ  [TP]
TP10  VDD  [TP]
TP12  +1V8  [TP]
TP13  2V5  [TP]
U9  STM32F373VCT6  [IC149-100-025-B5]  (part B of 2)
U16  ST1L05BPUR  [DFN6(3X3)]
U17  ST1L05BPUR  [DFN6(3X3)]
U20  BNX002-01  [BNX001]
U24  LD1117S25TR  [SOT-223]
U25  LD1086D2M33  [D2PAK/A]
U26  ZEN056V130A24LS  [polyzen]
Z1  SMAJ5.0A-TR  [1R1C]

### Ports
1V8_POR (out)

### Nets
+1V8: C37.1 C41.2 R99.2 R102.2 R114.1 TP12.1 U17.4(VO)
+2V5: C49.1 TP13.1 U24.2(Vout)
+3V3: C57.1 C58.1 JP12.3 R56.2 R97.2 TP7.1 U25.2(Vout)
+5V: C40.1 C42.1 C48.1 JP10.2 JP10.4 JP10.6 JP10.8 R53.2 TP8.1 U16.6(VI) U17.6(VI) U24.3(Vin) U25.3(Vin)
AGND: C4.1 C8.2 C102.1 C103.1 L3.2 SB5.2 SB6.2 SB7.2 SB12.2 SB15.2 SB19.2 SB20.2 SB21.2 SB22.2 U9.48(SD_VREF-) U9.49(SD_VSS)
D5V: JP10.1
E5V: C34.1 JP10.5 U20.3(CV)
GND: BT1.2(-) C20.1 C30.2 C31.2 C34.2 C36.2 C37.2 C38.2 C40.2 C42.2 C48.2 C49.2 C57.2 C58.2 C59.2 C99.2 C110.1 C112.2 C115.2 C116.2 C117.2 L3.1 LD8.2(K) R111.2 RV2.2(TAP) RV2.3(TOP) SB5.1 SB6.1 SB7.1 SB12.1 SB15.1 SB19.1 SB20.1 SB21.1 SB22.1 TP2.1 U9.20(VSSA/SAR_VREF-) U9.74(VSS_3) U9.99(VSS_1) U16.0(GND) U16.2(GND) U17.0(GND) U17.2(GND) U20.4(CG1) U20.5(CG2) U20.6(CG3) U24.1 U25.1(GND)
SAR_VREF+: C20.2 C116.1 JP17.2(NO) R32.2 TP5.1 U9.22(SAR_VREF+)
SD_VREF+: C4.2 C8.1 JP17.1(COMMON) TP4.1 U9.52(SD_VREF+)
U5V: JP10.3
U5V_ST_LINK: JP10.7
VDD: JP11.1 JP15.2(NO) R55.1 R102.1 TP10.1
VDD_ADJ: C31.1 C35.2 JP12.1 R57.2 R100.2 R106.1 TP9.1 U16.4(VO)
VDD_ANA: JP16.1(COMMON)
VDDA: C102.2 C103.2 C110.2 C117.1 L1.2 R32.1 R70.1 TP6.1 U9.21(VDDA) U9.50(SD1/2_VDD)
VDDIO: C59.1 C99.1 C112.1 C115.1 D4.1(A) JP13.1 JP15.1(COMMON) R58.1 R80.1 U9.28(VDD_2) U9.75(VDD_3) U9.100(VDD_1)
PB2: R98.1 ; port 1V8_POR
NetBT1_1: BT1.1(+) JP11.3
NetC30_1: C30.1 R98.2 R99.1 U17.3(PG)
NetC35_1: C35.1 R106.2 R107.1 U16.5(ADJ)
NetC36_1: C36.1 R97.1 U16.1(EN)
NetC38_1: C38.1 R100.1 U17.1(EN)
NetC41_1: C41.1 R111.1 R114.2 U17.5(ADJ)
NetC47_1: C47.1 U20.1(SV) U26.3 Z1.2(K)
NetC47_2: C47.2 CN18.2(GND) CN18.3(GND) U20.2(SG) U26.2 Z1.1(A)
NetCN18_1: CN18.1(+) U26.1
NetD4_2: D4.2(K) JP13.2 JP16.2(NO) L1.1 R58.2
NetJP11_2: JP11.2 U9.6(VBAT)
NetJP12_2: JP12.2 R55.2
NetJP13_3: JP13.3 R56.1 R57.1
NetLD8_1: LD8.1(A) R53.1
NetR70_2: R70.2 R80.2 U9.51(SD3_VDD)
NetR107_2: R107.2 RV2.1(BOT)

Not connected (* = marked no-connect by the designer): U16 3(PG)

### Notes on the sheet
- (near C31) [Ceramic]
- Power Supply VDD_ADJ [2.1V to 3.5V]
- Vout=1.22*(1+R1/R2)
- considering potentiometer error tolerance
- (near R98) PB2
- (near C37) [Ceramic]
- Power Supply 1.8V
- STM32373C-EVAL Power
- MB988
- 5
- 15
- STMicroelectronics
- Title:
- Number:
- Rev:
- Date:
- Sheet       of

### Library data of the parts
BT1 = BATTERY
C4 C20 C30 C31 C35-C38 C41 C57 C102 C103 C110 = Cap: Capacitor; Value: 10nF; Published: 8-Jun-2000; Revision: July-2002: Re-released for DXP Platform.; Publisher: Altium Limited
C8 C48 C116 C117 = Cap Pol1: as C95 on sheet ECG&PressureSensor; Published: 8-Jun-2000; Revision: July-2002: Re-released for DXP Platform.; Publisher: Altium Limited
C34 = Cap Pol1: Polarized Capacitor (Radial); Value: 47uF; Published: 8-Jun-2000; Revision: July-2002: Re-released for DXP Platform.; Publisher: Altium Limited
C40 C42 = Cap Pol1: as C3 on sheet ECG&PressureSensor; Published: 8-Jun-2000; Revision: July-2002: Re-released for DXP Platform.; Publisher: Altium Limited
C47 = CAP: Capacitor; Value: 100pF; Published: 8-Jun-2000; Revision: July-2002: Re-released for DXP Platform.; Publisher: Altium Limited
C49 C58 = Cap Pol1: Polarized Capacitor (Radial); Published: 8-Jun-2000; Revision: July-2002: Re-released for DXP Platform.; Publisher: Altium Limited; Value: 10uF
C59 C99 C112 C115 = CAP: Capacitor; Published: 8-Jun-2000; Revision: July-2002: Re-released for DXP Platform.; Publisher: Altium Limited; Value: 100nF
CN18 = PJ202A
D4 = Diode: Default Diode; Code - JEDEC: DO-214-AB; Published: 8-Jun-2000; Revision: July-2002: Re-released for DXP Platform.; Publisher: Altium Limited
JP10 = Header 4X2: Header, 4-Pin, Dual row; Revision: 17-Jul-2002: Re-released for DXP Platform.; Publisher: Altium Limited
JP11-JP13 = Jumper3
JP15-JP17 = JP2
L1 L3 = Inductor: Value: 100uH; Published: 8-Jun-2000; Revision: July-2002: Re-released for DXP Platform.; Publisher: Altium Limited
LD8 = LED2: as LD9 on sheet MCU; Published: 8-Jun-2000; Revision: July-2002: Re-released for DXP Platform.; Publisher: Altium Limited
R32 R55-R58 R70 R80 R98 R102 R106 R107 R111 R114 = Res1: Resistor; Value: 1K; Published: 8-Jun-2000; Revision: July-2002: Re-released for DXP Platform.; Publisher: Altium Limited
R53 R100 = res1: Resistor; Published: 8-Jun-2000; Revision: July-2002: Re-released for DXP Platform.; Publisher: Altium Limited; Value: 1K
R97 R99 = res1: Resistor; Value: 1K; Published: 8-Jun-2000; Revision: July-2002: Re-released for DXP Platform.; Publisher: Altium Limited
RV2 = RV
SB5-SB7 SB12 SB15 SB19-SB22 = Circuit Breaker: Published: 24-Mar-1999; Revision: July-2002: Re-released for DXP Platform.; Publisher: Altium Limited
TP2 TP4-TP10 TP12 TP13 = TP
U9 = Goldfish
U16 U17 = ST1L05
U20 = BNX002
U24 = LD1117
U25 = VOLTREG1
Z1 = D Schottky: Schottky Diode; Code - JEDEC: DO-214-AA; Published: 8-Jun-2000; Revision: July-2002: Re-released for DXP Platform.; Publisher: Altium Limited

## Sheet LCD_MicroSD.SchDoc
size A4; Revision: B.2
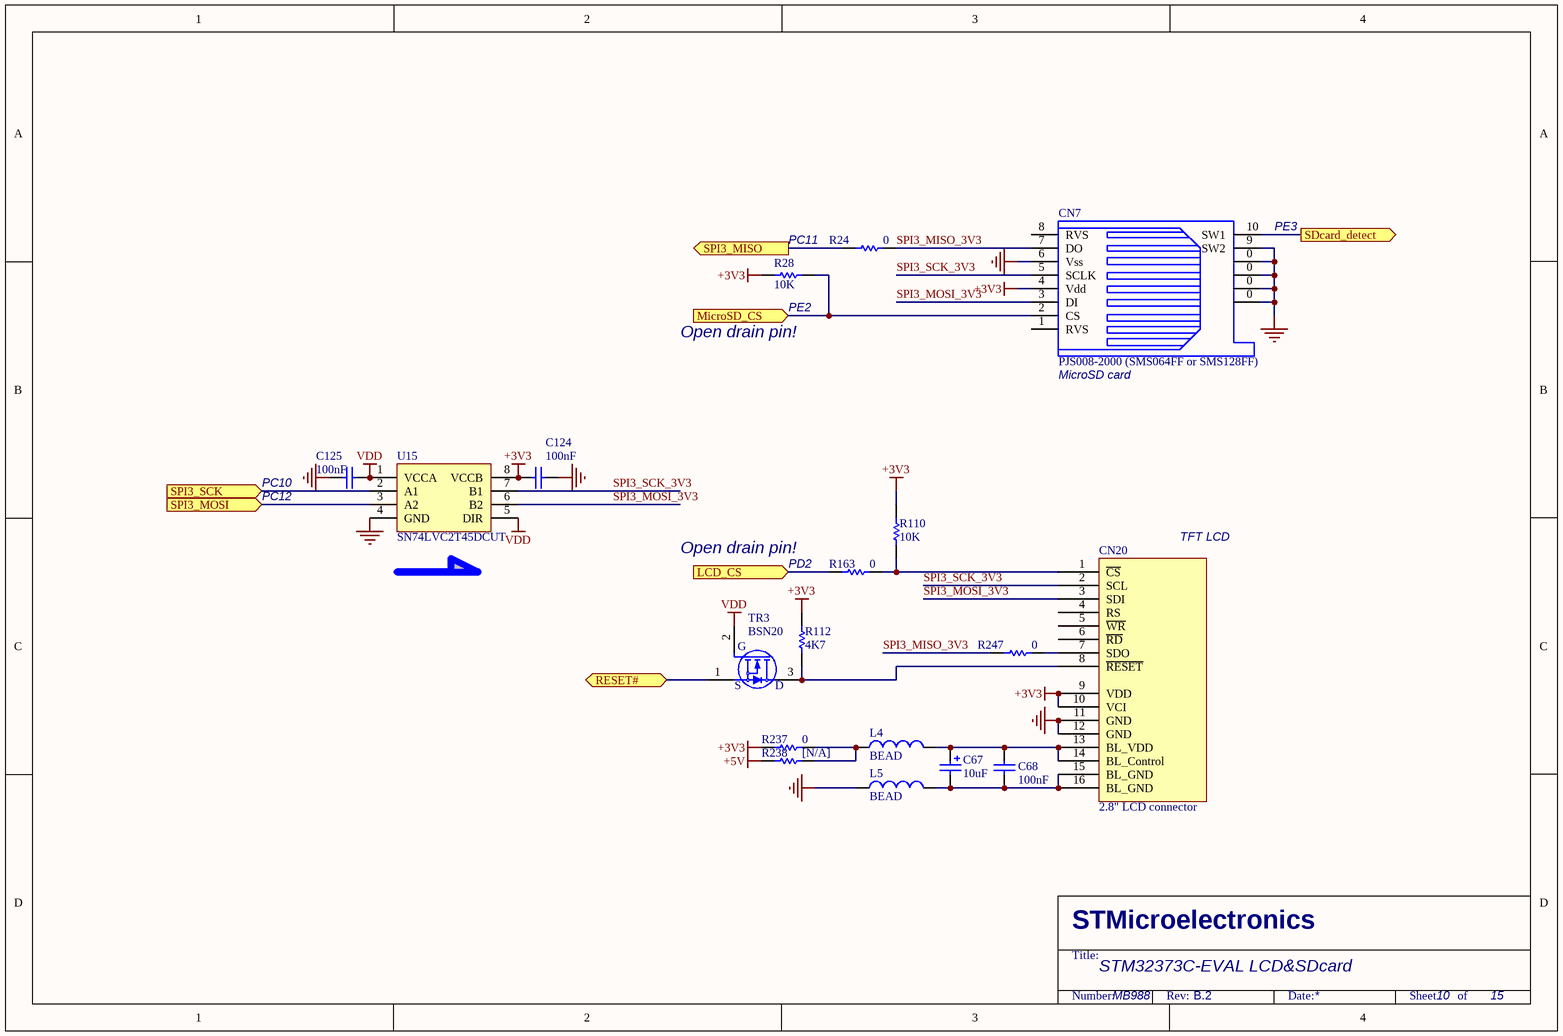
[diagram p8: LCD_MicroSD.SchDoc]

### Parts
C67  10uF  [TAN-A]
C68  100nF  [0603C]
C124  100nF  [0603C]
C125  100nF  [0603C]
CN7  PJS008-2000 (SMS064FF or SMS128FF)  [MSD(PJS008)]
CN20  2.8" LCD connector  [MB989]
L4  BEAD  [0603L]
L5  BEAD  [0603L]
R24  0  [0603R]
R28  10K  [0603R]
R110  10K  [0603R]
R112  4K7  [0603R]
R163  0  [0603R]
R237  0  [0603R]
R238  [N/A]  [0603R]
R247  0  [0603R]
TR3  BSN20  [SOT-23]
U15  SN74LVC2T45DCUT  [VSSOP8]

### Ports
LCD_CS (in), MicroSD_CS (in), RESET# (bidir), SDcard_detect (out), SPI3_MISO (out), SPI3_MOSI (in), SPI3_SCK (in)

### Nets
+3V3: C124.2 CN7.4(Vdd) CN20.9(VDD) CN20.10(VCI) R28.2 R110.2 R112.2 R237.1 U15.8(VCCB)
+5V: R238.1
GND: C124.1 C125.1 CN7.0 CN7.6(Vss) CN7.9(SW2) CN20.11(GND) CN20.12(GND) L5.1 U15.4(GND)
VDD: C125.2 TR3.2(G) U15.1(VCCA) U15.5(DIR)
PC10: U15.2(A1) ; port SPI3_SCK
PC11: R24.1 ; port SPI3_MISO
PC12: U15.3(A2) ; port SPI3_MOSI
PD2: R163.2 ; port LCD_CS
RESET#: TR3.1(S) ; port RESET#
SPI3_MISO_3V3: CN7.7(DO) R24.2 R247.2
SPI3_MOSI_3V3: CN7.3(DI) CN20.3(SDI) U15.6(B2)
SPI3_SCK_3V3: CN7.5(SCLK) CN20.2(SCL) U15.7(B1)
NetC67_1: C67.1 C68.1 CN20.13(BL_VDD) CN20.14(BL_Control) L4.2
NetC67_2: C67.2 C68.2 CN20.15(BL_GND) CN20.16(BL_GND) L5.2
NetCN7_2: CN7.2(CS) R28.1 ; port MicroSD_CS
NetCN7_10: CN7.10(SW1) ; port SDcard_detect
NetCN20_1: CN20.1(~{CS}) R110.1 R163.1
NetCN20_7: CN20.7(SDO) R247.1
NetCN20_8: CN20.8(~{RESET}) R112.1 TR3.3(D)
NetL4_1: L4.1 R237.2 R238.2

Not connected (* = marked no-connect by the designer): CN7 1(RVS) 8(RVS); CN20 4(RS) 5(~{WR}) 6(~{RD})

### Notes on the sheet
- PC11
- (near CN7) PE3
- (near R28) PE2
- (near R28) Open drain pin!
- (near CN7) MicroSD card
- PC10
- PC12
- (near R163) Open drain pin!
- PD2
- TFT LCD
- STM32373C-EVAL LCD&SDcard
- MB988
- 10
- 15
- STMicroelectronics
- Title:
- Number:
- Rev:
- Date:
- Sheet       of

### Library data of the parts
C67 = Cap Pol1: Polarized Capacitor (Radial); Published: 8-Jun-2000; Revision: July-2002: Re-released for DXP Platform.; Publisher: Altium Limited; Value: 10uF
C68 = Cap: Capacitor; Value: 10nF; Published: 8-Jun-2000; Revision: July-2002: Re-released for DXP Platform.; Publisher: Altium Limited
C124 C125 = CAP: Capacitor; Value: 100pF; Published: 8-Jun-2000; Revision: July-2002: Re-released for DXP Platform.; Publisher: Altium Limited
CN7 = SMS016AFA5E
CN20 = ColorLCD_module
L4 L5 = Inductor: Value: 100uH; Published: 8-Jun-2000; Revision: July-2002: Re-released for DXP Platform.; Publisher: Altium Limited
R24 R28 R110 R112 R163 R237 R238 = Res1: Resistor; Value: 1K; Published: 8-Jun-2000; Revision: July-2002: Re-released for DXP Platform.; Publisher: Altium Limited
R247 = res1: Resistor; Value: 1K; Published: 8-Jun-2000; Revision: July-2002: Re-released for DXP Platform.; Publisher: Altium Limited
TR3 = 2N7000